# Altium project CC_V1.4.PrjPCB (part 1 of 2)
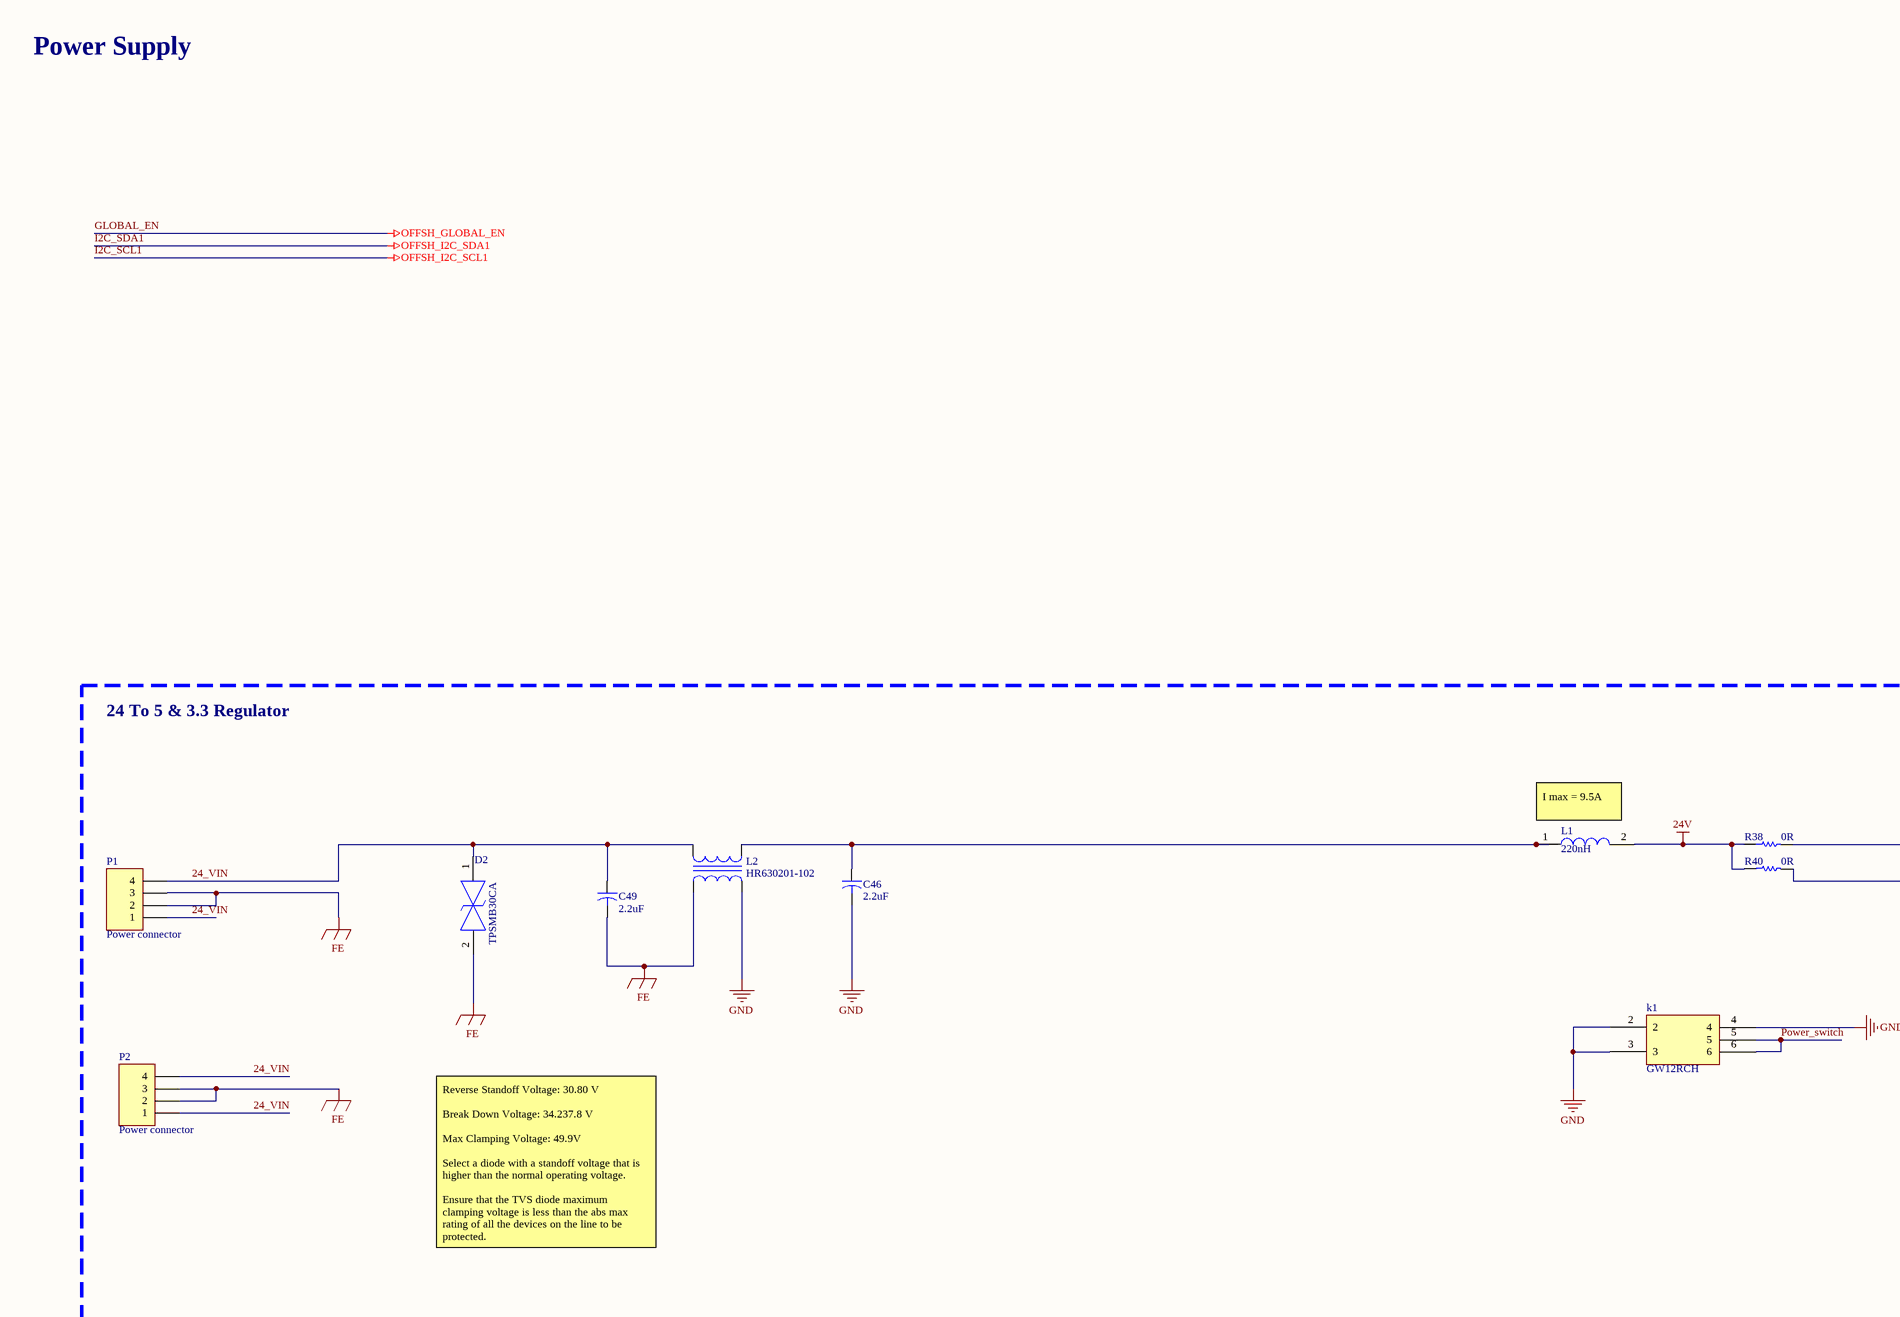
[diagram p0: Power_Supply.SchDoc, top left]
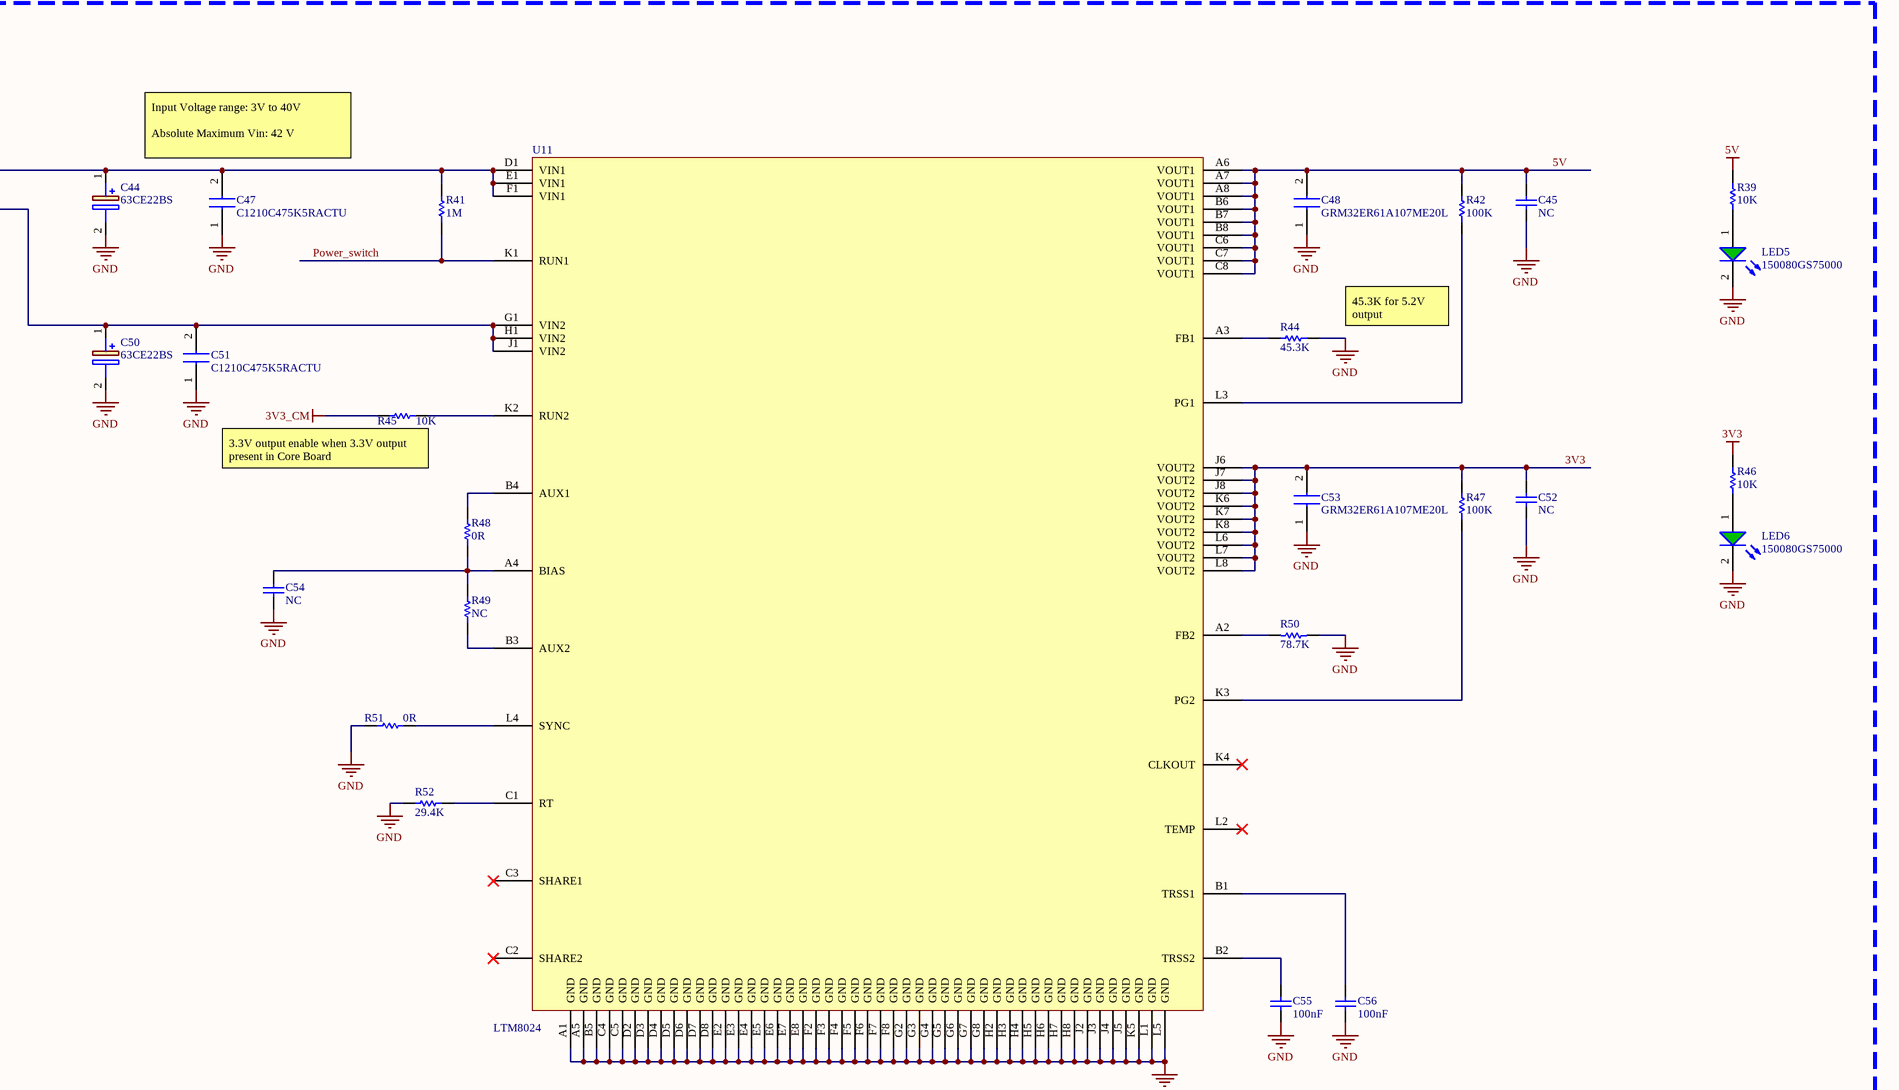
[diagram p1: Power_Supply.SchDoc, top right]
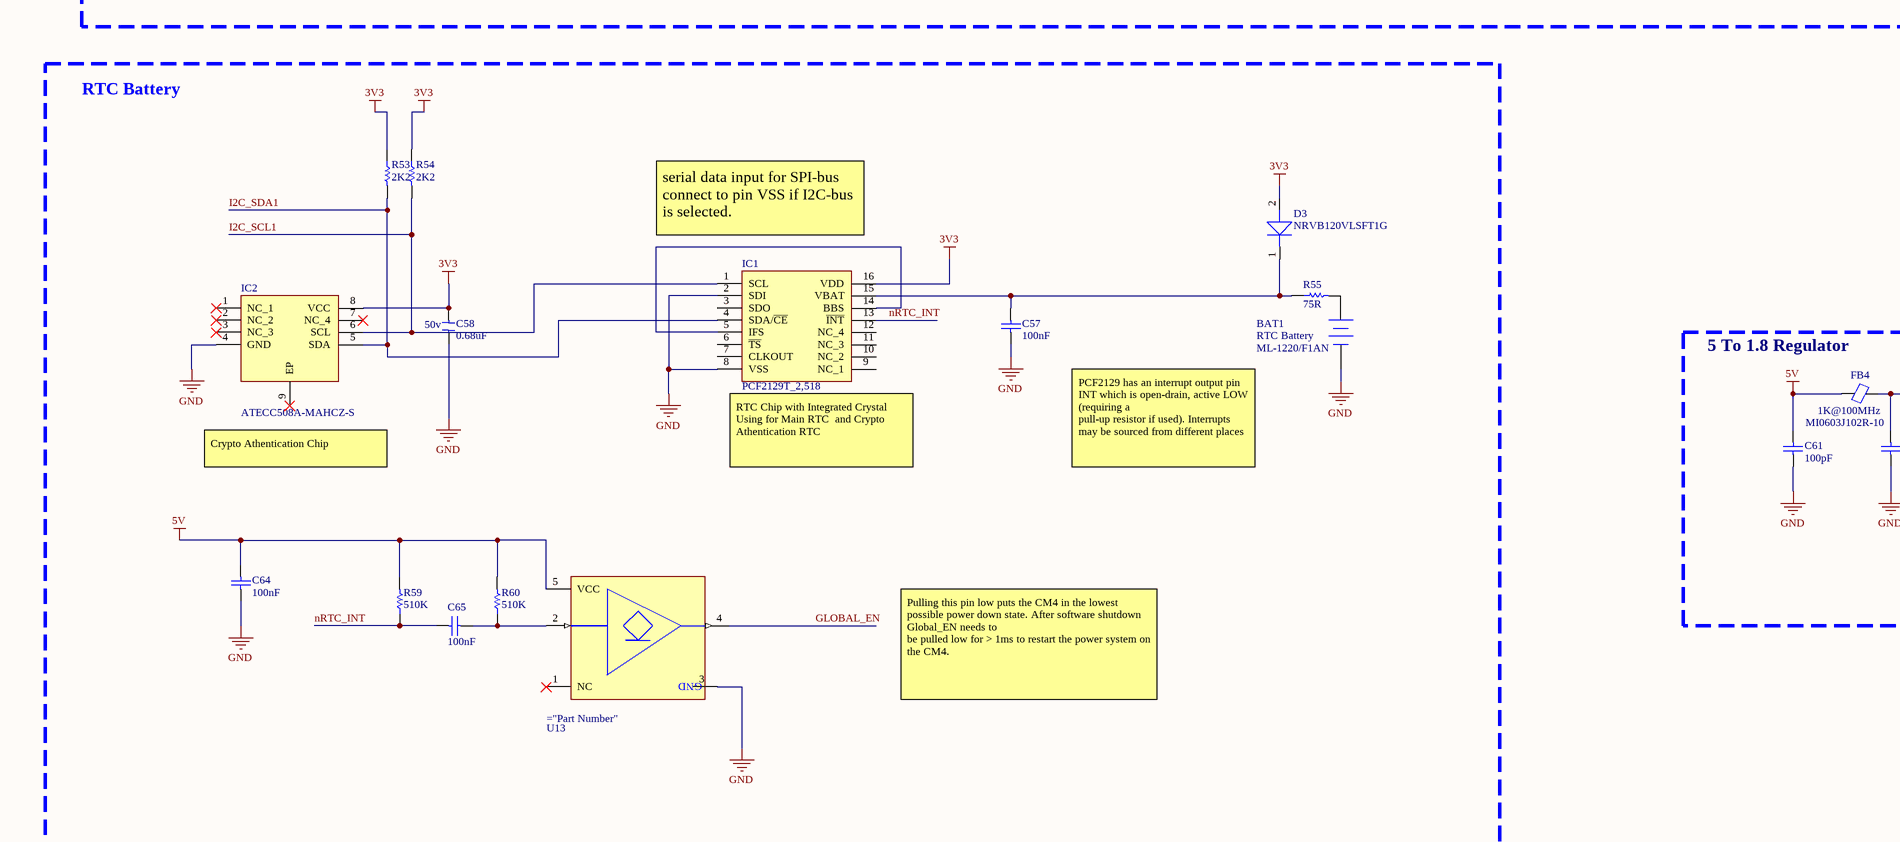
[diagram p2: Power_Supply.SchDoc, bottom left]
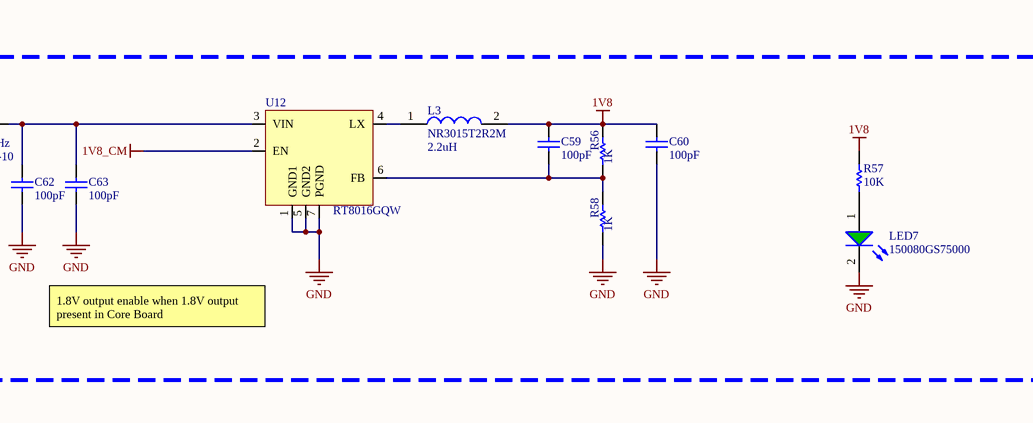
[diagram p3: Power_Supply.SchDoc, bottom right]
9 sheets, 334 parts. Net scope: global (net labels, ports and power ports of the same name join across sheets).
Board file: CC_V1.4.PcbDoc
Sheets:
  Power_Supply.SchDoc
  SPI_To_Ethernet.SchDoc
  HDMI_MicroUSB.SchDoc
  USB_To_Ethernet.SchDoc
  CoreBoard.SchDoc
  4G.SchDoc
  LCD.SchDoc
  DIO.SchDoc
  Audio.SchDoc

## Sheet Power_Supply.SchDoc
size A1

### Parts
(Parts that share a designator on the sheet are numbered #1, #2 ... from top to bottom, then left to right.)
BAT1  RTC Battery  Part Number: ML-1220/F1AN  [ML-1220F1AN]
C44  63CE22BS  [63CE22BS]
C45  value NC  [CAP (0603)]  (hidden comment: Cap)
C46  value 2.2uF  [TANTAL (SIZE B)]  (hidden comment: Cap_Tantal)
C47  C1210C475K5RACTU  [CAPC3225X280N]
C48  GRM32ER61A107ME20L  [CAPC3225X270N]
C49  value 2.2uF  [TANTAL (SIZE B)]  (hidden comment: Cap_Tantal)
C50  63CE22BS  [63CE22BS]
C51  C1210C475K5RACTU  [CAPC3225X280N]
C52  value NC  [CAP (0603)]  (hidden comment: Cap)
C53  GRM32ER61A107ME20L  [CAPC3225X270N]
C54  value NC  [CAP (0603)]  (hidden comment: Cap)
C55  value 100nF  [CAP (0603)]  (hidden comment: Cap)
C56  value 100nF  [CAP (0603)]  (hidden comment: Cap)
C57  value 100nF  [CAP (0603)]  (hidden comment: Cap)
C58  value 0.68uF  Voltage: 50v  [0603 Capacitor]  (hidden comment: Capacitor SMD)
C59  value 100pF  [CAP (0603)]  (hidden comment: Cap)
C60  value 100pF  [CAP (0603)]  (hidden comment: Cap)
C61  value 100pF  [CAP (0603)]  (hidden comment: Cap)
C62  value 100pF  [CAP (0603)]  (hidden comment: Cap)
C63  value 100pF  [CAP (0603)]  (hidden comment: Cap)
C64  value 100nF  [CAP (0603)]  (hidden comment: Cap)
C65  value 100nF  [CAP (0603)]  (hidden comment: Cap)
D2  TPSMB30CA  [DIONM5444X261N]
D3  Schottky Diode  [SODFL3616X98N (SOD-123FL)]  (value not drawn)
FB4  value 1K@100MHz  Part Number: MI0603J102R-10  [FB0603]  (hidden comment: Ferrite Bead)
IC1  PCF2129T_2,518  [SOIC127P1032X265-16N]
IC2  ATECC508A-MAHCZ-S  [DFN200X300X60-9N]
k1  GW12RCH  [PCBComponent_1]
L1#1  220nH  [WE-LHMI_402048]
L2  HR630201-102  [PCBComponent_1 - duplicate]
L3  value 2.2uH  [NR3015T2R2M]  (hidden comment: Inductor)
LED5  150080GS75000  [LED_0805_Green]
LED6  150080GS75000  [LED_0805_Green]
LED7  150080GS75000  [LED_0805_Green]
P1  Power connector  [XH_4Pin]
P2  Power connector  [XH_4Pin]
R38  value 0R  [RES (0603)]  (hidden comment: Res)
R39  value 10K  [R0603]  (hidden comment: Res)
R40  value 0R  [RES (0603)]  (hidden comment: Res)
R41  value 1M  [RES 0603]  (hidden comment: Res)
R42  value 100K  [RES (0603)]  (hidden comment: Res)
R44  value 45.3K  [RES (0603)]  (hidden comment: Res)
R45  value 10K  [RES (0603)]  (hidden comment: Res)
R46  value 10K  [R0603]  (hidden comment: Res)
R47  value 100K  [RES (0603)]  (hidden comment: Res)
R48  value 0R  [RES (0603)]  (hidden comment: Res)
R49  value NC  [RES (0603)]  (hidden comment: Res)
R50  value 78.7K  [RES (0603)]  (hidden comment: Res)
R51  value 0R  [RES (0603)]  (hidden comment: Res)
R52  value 29.4K  [RES (0603)]  (hidden comment: Res)
R53  value 2K2  [RES 0603]  (hidden comment: Res)
R54  value 2K2  [RES 0603]  (hidden comment: Res)
R55  value 75R  [RES (0603)]  (hidden comment: Res)
R56  value 1K  [R0603]  (hidden comment: Res)
R57  value 10K  [R0603]  (hidden comment: Res)
R58  value 1K  [R0603]  (hidden comment: Res)
R59  value 510K  [RES (0603)]  (hidden comment: Res)
R60  value 510K  [RES (0603)]  (hidden comment: Res)
U11  LTM8024  [BGA88C100P8X11_900X1125X352]
U12  RT8016GQW  [SON65P200X200X80-7N (WDFN-6L)]
U13  74LVC1G07SE-7  [SOT65P210X110-5N]  (value not drawn)

### Nets
1V8: C59.1 C60.1 L3.2 R56.2 R57.1
1V8_CM: U12.2(EN)
3V3: C52.1 C53.2 C58.2 D3.2(A) IC1.16(VDD) IC2.8(VCC) R46.1 R47.2 R53.1 R54.1 U11.J6(VOUT2) U11.J7(VOUT2) U11.J8(VOUT2) U11.K6(VOUT2) U11.K7(VOUT2) U11.K8(VOUT2) U11.L6(VOUT2) U11.L7(VOUT2) U11.L8(VOUT2)
3V3_CM: R45.2
5V: C45.1 C48.2 C61.1 C64.1 FB4.1 R39.1 R42.2 R59.2 R60.2 U11.A6(VOUT1) U11.A7(VOUT1) U11.A8(VOUT1) U11.B6(VOUT1) U11.B7(VOUT1) U11.B8(VOUT1) U11.C6(VOUT1) U11.C7(VOUT1) U11.C8(VOUT1) U13.5(VCC)
24V: L1#1.2 R38.1 R40.1
FE: C49.2 D2.2 L2.4 P1.2 P1.3 P2.2 P2.3
GLOBAL_EN: U13.4(Y)  [also labelled OFFSH_GLOBAL_EN]
GND: BAT1.2(-) C44.2(-) C45.2 C46.2 C47.1 C48.1 C50.2(-) C51.1 C52.2 C53.1 C54.1 C55.1 C56.1 C57.2 C58.1 C60.2 C61.2 C62.2 C63.2 C64.2 IC1.2(SDI) IC1.8(VSS) IC2.4(GND) k1.2 k1.3 k1.4 L2.2 LED5.2(C) LED6.2(C) LED7.2(C) R44.1 R50.1 R51.1 R52.2 R58.1 U11.A1(GND) U11.A5(GND) U11.B5(GND) U11.C4(GND) U11.C5(GND) U11.D2(GND) U11.D3(GND) U11.D4(GND) U11.D5(GND) U11.D6(GND) U11.D7(GND) U11.D8(GND) U11.E2(GND) U11.E3(GND) U11.E4(GND) U11.E5(GND) U11.E6(GND) U11.E7(GND) U11.E8(GND) U11.F2(GND) U11.F3(GND) U11.F4(GND) U11.F5(GND) U11.F6(GND) U11.F7(GND) U11.F8(GND) U11.G2(GND) U11.G3(GND) U11.G4(GND) U11.G5(GND) U11.G6(GND) U11.G7(GND) U11.G8(GND) U11.H2(GND) U11.H3(GND) U11.H4(GND) U11.H5(GND) U11.H6(GND) U11.H7(GND) U11.H8(GND) U11.J2(GND) U11.J3(GND) U11.J4(GND) U11.J5(GND) U11.K5(GND) U11.L1(GND) U11.L5(GND) U12.1(GND1) U12.5(GND2) U12.7(PGND)
I2C_SCL1: IC1.1(SCL) IC2.6(SCL) R54.2  [also labelled OFFSH_I2C_SCL1]
I2C_SDA1: IC1.4(SDA/~{CE}) IC2.5(SDA) R53.2  [also labelled OFFSH_I2C_SDA1]
24_VIN: C49.1 D2.1 L2.3 P1.1 P1.4 P2.1 P2.4
nRTC_INT: C65.2 IC1.13(~{INT}) R59.1
Power_switch: k1.5 k1.6 R41.1 U11.K1(RUN1)
NetBAT1_1: BAT1.1(+) R55.2
NetC44_1: C44.1(+) C47.2 R38.2 R41.2 U11.D1(VIN1) U11.E1(VIN1) U11.F1(VIN1)
NetC46_1: C46.1 L1#1.1 L2.1
NetC50_1: C50.1(+) C51.2 R40.2 U11.G1(VIN2) U11.H1(VIN2) U11.J1(VIN2)
NetC54_2: C54.2 R48.1 R49.2 U11.A4(BIAS)
NetC55_2: C55.2 U11.B2(TRSS2)
NetC56_2: C56.2 U11.B1(TRSS1)
NetC57_1: C57.1 D3.1(K) IC1.15(VBAT) R55.1
NetC59_2: C59.2 R56.1 R58.2 U12.6(FB)
NetC62_1: C62.1 C63.1 FB4.2 U12.3(VIN)
NetC65_1: C65.1 R60.1 U13.2(A)
NetIC1_5: IC1.5(IFS) IC1.14(BBS)
NetL3_1: L3.1 U12.4(LX)
NetLED5_1: LED5.1(A) R39.2
NetLED6_1: LED6.1(A) R46.2
NetLED7_1: LED7.1(A) R57.2
NetR42_1: R42.1 U11.L3(PG1)
NetR44_2: R44.2 U11.A3(FB1)
NetR45_1: R45.1 U11.K2(RUN2)
NetR47_1: R47.1 U11.K3(PG2)
NetR48_2: R48.2 U11.B4(AUX1)
NetR49_1: R49.1 U11.B3(AUX2)
NetR50_2: R50.2 U11.A2(FB2)
NetR51_2: R51.2 U11.L4(SYNC)
NetR52_1: R52.1 U11.C1(RT)

Not connected (* = marked no-connect by the designer): IC1 3(SDO) 6(~{TS}) 7(CLKOUT) 9(NC_1) 10(NC_2) 11(NC_3) 12(NC_4); IC2 1(NC_1)* 2(NC_2)* 3(NC_3)* 7(NC_4)* 9(EP)*; U11 C2(SHARE2)* C3(SHARE1)* K4(CLKOUT)* L2(TEMP)*; U13 1(NC)* 3(GND)

### Notes on the sheet
- Power Supply
- 24 To 5 & 3.3 Regulator
- (near L1#1) I max = 9.5A
- Input Voltage range: 3V to 40V
  Absolute Maximum Vin: 42 V
- (near R44) 45.3K for 5.2V output
- (near R45) 3.3V output enable when 3.3V output present in Core Board
- Reverse Standoff Voltage: 30.80 V
  Break Down Voltage: 34.237.8 V
  Max Clamping Voltage: 49.9V
  Select a diode with a standoff voltage that is higher than the normal operating voltage.
  Ensure that the TVS diode maximum clamping voltage is less than the abs max rating of all the devices on the line to be protected.
- RTC Battery
- serial data input for SPI-bus
  connect to pin VSS if I2C-bus is selected.
- (near FB4) 5 To 1.8 Regulator
- Crypto Athentication Chip
- (near IC1) RTC Chip with Integrated Crystal
  Using for Main RTC  and Crypto Athentication RTC
- PCF2129 has an interrupt output pin INT which is open-drain, active LOW (requiring a
  pull-up resistor if used). Interrupts may be sourced from different places
- 1.8V output enable when 1.8V output present in Core Board
- Pulling this pin low puts the CM4 in the lowest possible power down state. After software shutdown Global_EN needs to
  be pulled low for > 1ms to restart the power system on the CM4.

### Library data of the parts
BAT1 = RTC BAT (ML-1220_F1AN): Manufacturer_Name: Panasonic Battery; Datasheet Link: http://media.digikey.com/pdf/Data%20Sheets/Panasonic%20Inustrial/ML_Serie.pdf; Link: https://www.digikey.com/product-detail/en/panasonic-bsg/ML-1220-F1AN/P295-ND/447504
C44 C50 = 63CE22BS: Capacitor Polarised; Manufacturer_Name: Suncon; Value: 22uF; Datasheet Link: http://www.sunelec.co.jp/common/pdf/eng/CE-BS.pdf; Height: 8mm; Manufacturer_Part_Number: 63CE22BS; Arrow Part Number: 63CE22BS
C45 C52 C54 = Cap: SMD capacitor; Part Number: SMD CAP (0603)
C46 C49 = Cap_Tantal: Tantalum Capacitor; Voltage: 10V
C47 C51 = C1210C475K5RACTU: Capacitor, 4.7uF, 50V; Manufacturer_Name: Kemet; Datasheet Link: https://componentsearchengine.com/Datasheets/2/C1210C475K5RACTU.pdf; Height: 2.8mm; Manufacturer_Part_Number: C1210C475K5RACTU; Arrow Part Number: C1210C475K5RACTU; Arrow Price/Stock: https://www.arrow.com/en/products/c1210c475k5ractu/kemet-corporation; Mouser Part Number: 80-C1210C475K5R; Mouser Price/Stock: https://www.mouser.co.uk/ProductDetail/KEMET/C1210C475K5RACTU?qs=dB0LedT%252BmmBpncka1nOCUg%3D%3D; Value: 4.7uF; Voltage: 50V; Package: 1210
C48 C53 = GRM32ER61A107ME20L: Capacitor, 100uF, 10V; Manufacturer_Name: Murata Electronics; Datasheet Link: https://psearch.en.murata.com/capacitor/product/%23.html; Height: 2.7mm; Manufacturer_Part_Number: GRM32ER61A107ME20L; Arrow Part Number: GRM32ER61A107ME20L; Arrow Price/Stock: https://www.arrow.com/en/products/grm32er61a107me20l/murata-manufacturing; Mouser Part Number: 81-GRM32ER61A107ME0L; Mouser Price/Stock: https://www.mouser.co.uk/ProductDetail/Murata-Electronics/GRM32ER61A107ME20L?qs=QRVci0nWsCb7NlWFDLlBHA%3D%3D; Value: 100uF
C55-C57 C61-C65 = Cap: SMD capacitor; Part Number: SMD CAP (0603); Voltage: 50V
C59 C60 = Cap: SMD capacitor; Voltage: 50V
D2 = TPSMB62CA: Partnumber : TPSMB110CA; Manufacturer_Part_Number: TPSMB110CA
D3 = NRVB120VLSFT1G: Manufacturer_Name: ON Semiconductor; Datasheet Link: http://www.onsemi.com/pub/Collateral/MBR120VLSFT1-D.PDF; Height: 0.98mm; Link: https://www.digikey.com/product-detail/en/on-semiconductor/NRVB120VLSFT1G/NRVB120VLSFT1GOSCT-ND/8538727; Part Number: NRVB120VLSFT1G
FB4 = Ferrite Bead: Ferrite Bead SMD; Link: https://www.digikey.com/product-detail/en/laird-signal-integrity-products/MI0805J102R-10/240-2551-1-ND/1015989
IC1 = PCF2129T_2,518: Integrated Circuit; Manufacturer_Name: NXP; Manufacturer_Part_Number: PCF2129T/2,518; Datasheet Link: http://www.nxp.com/docs/en/data-sheet/PCF2129.pdf; Height: 2.65mm; Mouser Part Number: 771-PCF2129T/2,518; Mouser Price/Stock: https://www.mouser.co.uk/ProductDetail/NXP-Semiconductors/PCF2129T-2518/?qs=O0BhuZj9Wkzo98h9NloC7Q%3D%3D; Arrow Part Number: PCF2129T/2,518; Arrow Price/Stock: https://www.arrow.com/en/products/pcf2129t2518/nxp-semiconductors
IC2 = ATECC508A-MAHCZ-S: Integrated Circuit; Manufacturer_Name: Microchip; Datasheet Link: http://www.mouser.com/ds/2/268/Atmel-8923S-CryptoAuth-ATECC508A-Datasheet-Summary-1065793.pdf; Height: 0.6mm; Manufacturer_Part_Number: ATECC508A-MAHCZ-S; Mouser Part Number: 556-ATECC508AMAHCZS; Mouser Price/Stock: https://www.mouser.co.uk/ProductDetail/Microchip-Technology-Atmel/ATECC508A-MAHCZ-S?qs=%2FPOkb%252BiDxRUOydmISUnqmg%3D%3D; Arrow Part Number: ATECC508A-MAHCZ-S; Arrow Price/Stock: https://www.arrow.com/en/products/atecc508a-mahcz-s/microchip-technology
L1#1 = 744373240022: Manufacturer_Name: Wurth Elektronik; Datasheet Link: http://componentsearchengine.com/Datasheets/1/744373240022.pdf; Manufacturer_Part_Number: 744373240022; Arrow Part Number: 744373240022; Mouser Part Number: 710-744373240022; Mouser Price/Stock: https://www.mouser.co.uk/ProductDetail/Wurth-Elektronik/744373240022?qs=cFlH0mFHHFrAuUoRjqUUNw%3D%3D; Part Number: 744373240022
L2 = TRANS1
L3 = NR3015T2R2M: Manufacturer_Name: TAIYO YUDEN; Datasheet Link: http://ds.yuden.co.jp/TYCOMPAS/ut/detail.do?productNo=NR3015T2R2M&fileName=NR3015T2R2M_SS&mode=specSheetDownload; Link: https://www.digikey.com/product-detail/en/taiyo-yuden/NR3015T2R2M/587-1648-1-ND/1008263; Part Number: NR3015T2R2M
LED5-LED7 = WL-SMCW 0805  150080GS75000: SMD mono-color Chip LED, WL-SMCW, Green; Manufacturer: W黵th Elektronik eiSos GmbH; PartNo: 150080GS75000; ComponentLink1Description: Manufacturer; ComponentLink1URL: http://www.we-online.de; Created by: Christin Otto; Created Date: June 2013; ComponentLink2Description: Datasheet; ComponentLink2URL: http://katalog.we-online.com/led/datasheet/150080GS75000.pdf; Color: Green
P1 P2 = Header 4: CONN HEADER VERT 4POS 2.5MM JST Sales America Inc., B4B-XH-AM(LF)(SN); LatestRevisionDate: 17-Jul-2002; LatestRevisionNote: Re-released for DXP Platform.; Publisher: Altium Limited; Part Number: B4B-XH-AM(LF)(SN)
R38 R40-R42 R44 R45 R47-R55 = Res: SMD resistor; Tolerance: 5%
R39 R46 R56-R58 = Res: Resistor; Published: 8-Jun-2000; LatestRevisionDate: 17-Jul-2002; LatestRevisionNote: Re-released for DXP Platform.; PackageReference: AXIAL-0.3; Publisher: Altium Limited
R59 R60 = Res: SMD resistor; Tolerance: 1%
U12 = RT8016GQW: Step-Down Converter; Manufacturer_Name: RICHTEK; Datasheet Link: https://componentsearchengine.com/Datasheets/2/RT8010GQW.pdf; Height: 0.8mm; Link: https://www.digikey.com/product-detail/en/richtek-usa-inc/RT8016GQW/1028-1031-1-ND/3071294; Part Number: RT8016GQW

## Sheet SPI_To_Ethernet.SchDoc
size A1
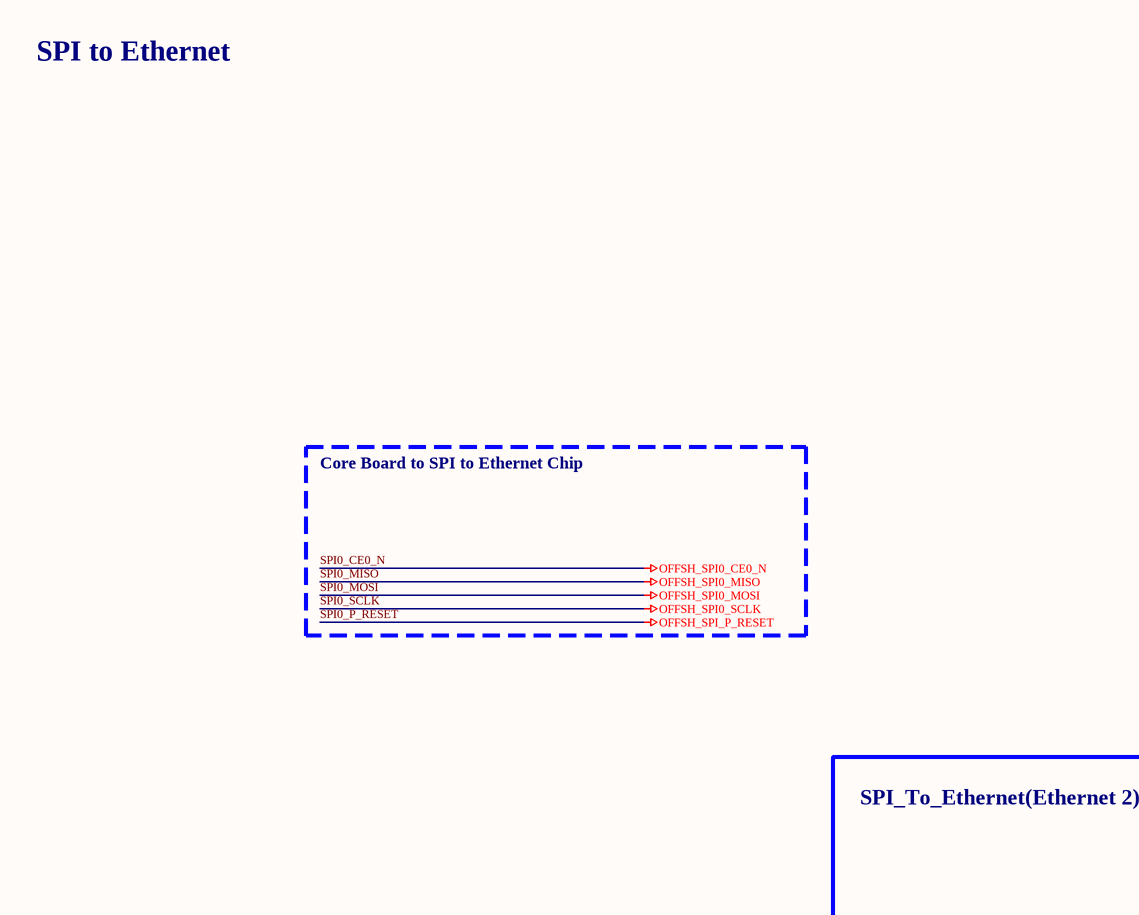
[diagram p4: SPI_To_Ethernet.SchDoc, top left]
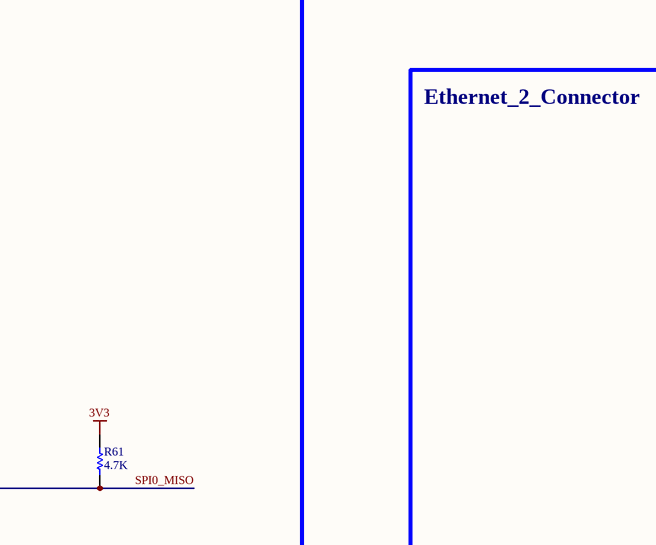
[diagram p5: SPI_To_Ethernet.SchDoc, top right]
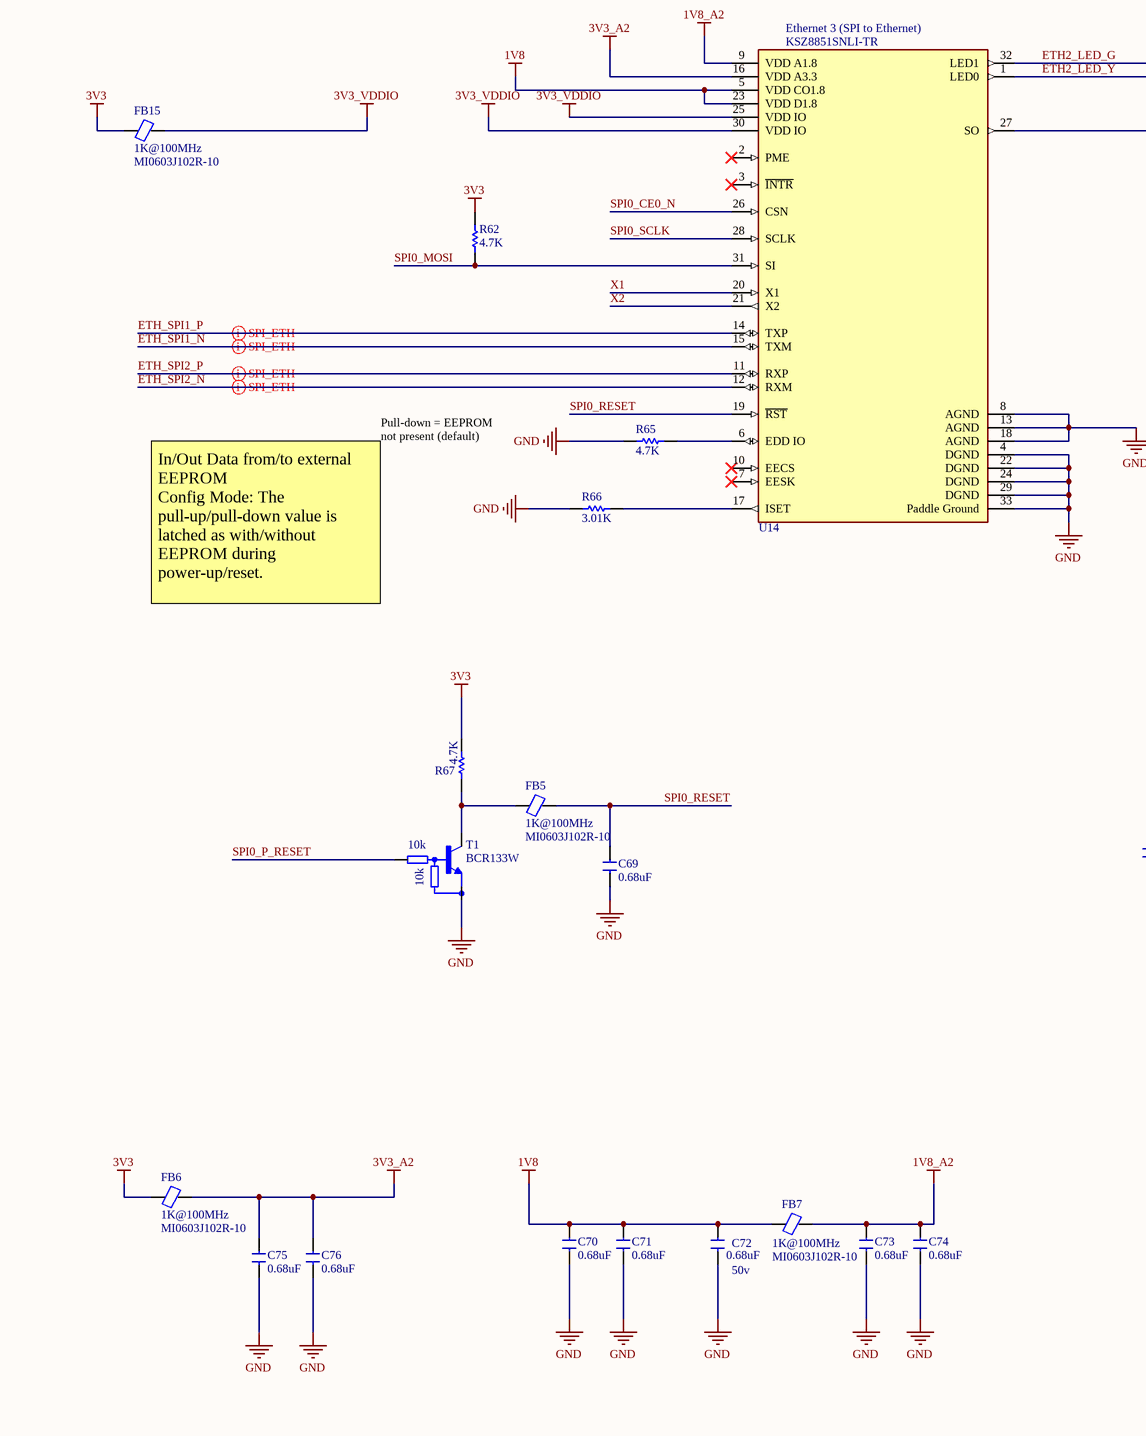
[diagram p6: SPI_To_Ethernet.SchDoc, bottom left]
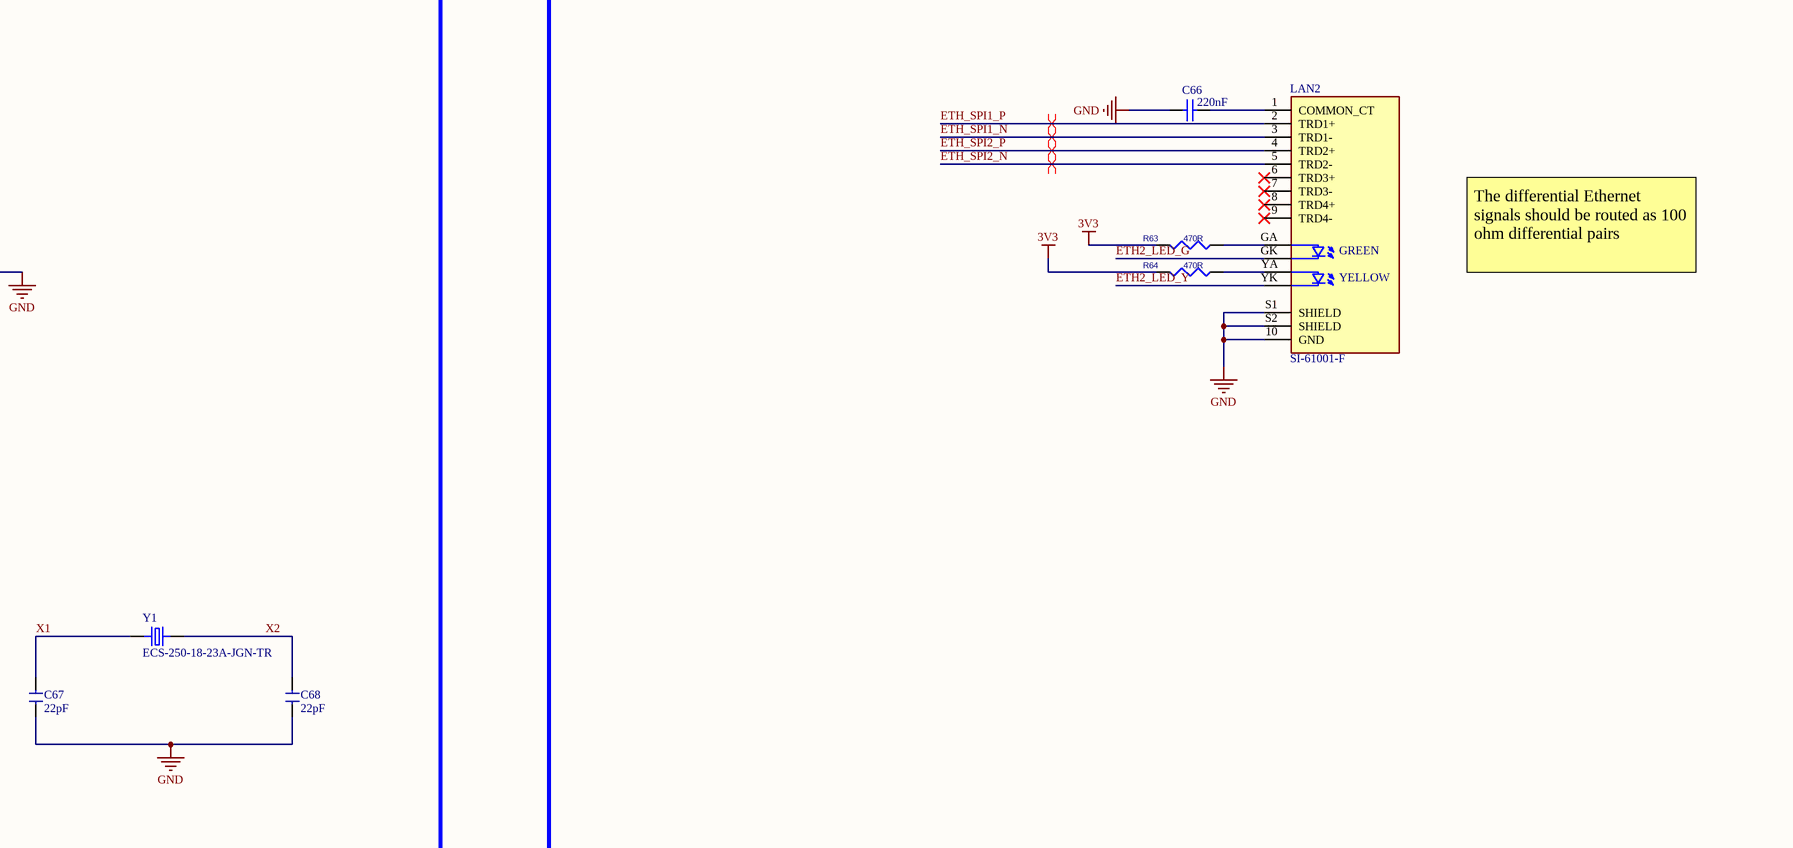
[diagram p7: SPI_To_Ethernet.SchDoc, bottom right]

### Parts
C66  value 220nF  [CAP (0603)]  (hidden comment: Cap)
C67  value 22pF  [0603 Capacitor]  (hidden comment: Capacitor SMD)
C68  value 22pF  [0603 Capacitor]  (hidden comment: Capacitor SMD)
C69  value 0.68uF  [0603 Capacitor]  (hidden comment: Capacitor SMD)
C70  value 0.68uF  [0603 Capacitor]  (hidden comment: Capacitor SMD)
C71  value 0.68uF  [0603 Capacitor]  (hidden comment: Capacitor SMD)
C72  value 0.68uF  Voltage: 50v  [0603 Capacitor]  (hidden comment: Capacitor SMD)
C73  value 0.68uF  [0603 Capacitor]  (hidden comment: Capacitor SMD)
C74  value 0.68uF  [0603 Capacitor]  (hidden comment: Capacitor SMD)
C75  value 0.68uF  [0603 Capacitor]  (hidden comment: Capacitor SMD)
C76  value 0.68uF  [0603 Capacitor]  (hidden comment: Capacitor SMD)
FB5  value 1K@100MHz  Part Number: MI0603J102R-10  [FB0603]  (hidden comment: Ferrite Bead)
FB6  value 1K@100MHz  Part Number: MI0603J102R-10  [FB0603]  (hidden comment: Ferrite Bead)
FB7  value 1K@100MHz  Part Number: MI0603J102R-10  [FB0603]  (hidden comment: Ferrite Bead)
FB15  value 1K@100MHz  Part Number: MI0603J102R-10  [FB0603]  (hidden comment: Ferrite Bead)
LAN2  SI-61001-F  [BEL_SI-61001-F]
R61  value 4.7K  [R0603]  (hidden comment: Res)
R62  value 4.7K  [R0603]  (hidden comment: Res)
R63  470R  [R0603]
R64  470R  [R0603]
R65  value 4.7K  [R0603]  (hidden comment: Res)
R66  value 3.01K  [R0603]  (hidden comment: Res)
R67  value 4.7K  [R0603]  (hidden comment: Res)
T1  BCR133W  [SOT323-BEC]
U14  KSZ8851SNLI-TR  [QFN50P500X500X90-33N]
Y1  ECS-250-18-23A-JGN-TR  [XTAL_ECS-250-18-23A-JGN-TR]

### Blocks framed on the sheet
SPI_To_Ethernet(Ethernet 2): C67-C76 FB5-FB7 FB15 R61 R62 R65-R67 T1 U14 Y1
Ethernet_2_Connector: C66 LAN2 R63 R64

### Nets
1V8: C70.1 C71.1 C72.2 FB7.1 U14.5(VDD_CO1.8) U14.23(VDD_D1.8)
1V8_A2: C73.1 C74.1 FB7.2 U14.9(VDD_A1.8)
3V3: FB6.1 FB15.1 R61.2 R62.2 R63.1 R64.1 R67.2
3V3_A2: C75.1 C76.1 FB6.2 U14.16(VDD_A3.3)
3V3_VDDIO: FB15.2 U14.25(VDD_IO) U14.30(VDD_IO)
GND: C66.1 C67.2 C68.2 C69.2 C70.2 C71.2 C72.1 C73.2 C74.2 C75.2 C76.2 LAN2.10(GND) LAN2.S1(SHIELD) LAN2.S2(SHIELD) R65.1 R66.1 T1.E U14.4(DGND) U14.8(AGND) U14.13(AGND) U14.18(AGND) U14.22(DGND) U14.24(DGND) U14.29(DGND) U14.33(Paddle_Ground)
SPI0_CE0_N: U14.26(CSN)  [also labelled OFFSH_SPI0_CE0_N]
SPI0_MISO: R61.1 U14.27(SO)  [also labelled OFFSH_SPI0_MISO]
SPI0_MOSI: R62.1 U14.31(SI)  [also labelled OFFSH_SPI0_MOSI]
SPI0_P_RESET: T1.B  [also labelled OFFSH_SPI_P_RESET]
SPI0_SCLK: U14.28(SCLK)  [also labelled OFFSH_SPI0_SCLK]
ETH2_LED_G: LAN2.GK U14.32(LED1)
ETH2_LED_Y: LAN2.YK U14.1(LED0)
ETH_SPI1_N: LAN2.3(TRD1-) U14.15(TXM)
ETH_SPI1_P: LAN2.2(TRD1+) U14.14(TXP)
ETH_SPI2_N: LAN2.5(TRD2-) U14.12(RXM)
ETH_SPI2_P: LAN2.4(TRD2+) U14.11(RXP)
SPI0_RESET: C69.1 FB5.2 U14.19(~{RST})
X1: C67.1 U14.20(X1) Y1.1(IN/OUT)
X2: C68.1 U14.21(X2) Y1.2(OUT/IN)
NetC66_2: C66.2 LAN2.1(COMMON_CT)
NetFB5_1: FB5.1 R67.1 T1.C
NetLAN2_GA: LAN2.GA R63.2
NetLAN2_YA: LAN2.YA R64.2
NetR65_2: R65.2 U14.6(EDD_IO)
NetR66_2: R66.2 U14.17(ISET)

Not connected (* = marked no-connect by the designer): LAN2 6(TRD3+)* 7(TRD3-)* 8(TRD4+)* 9(TRD4-)*; U14 2(PME)* 3(~{INTR})* 7(EESK)* 10(EECS)*

### Layout directives
differential pair; differential pair class SPI_ETH: ETH_SPI1_N, ETH_SPI1_P, ETH_SPI2_N, ETH_SPI2_P
differential pair: ETH_SPI1_N, ETH_SPI1_P, ETH_SPI2_N, ETH_SPI2_P

### Notes on the sheet
- SPI to Ethernet
- Core Board to SPI to Ethernet Chip
- (near U14) Ethernet 3 (SPI to Ethernet)
- Pull-down = EEPROM not present (default)
- The differential Ethernet signals should be routed as 100 ohm differential pairs
- In/Out Data from/to external EEPROM
  Config Mode: The pull-up/pull-down value is latched as with/without
  EEPROM during power-up/reset.
- (in symbol BCR133W) 10k
- (in symbol SI-61001-F) GREEN; YELLOW

### Library data of the parts
C66 = Cap: as C45 on sheet Power_Supply
C67-C71 C73-C76 = Capacitor SMD: Voltage: 50v
FB5-FB7 FB15 = Ferrite Bead: Ferrite Bead SMD; Link: https://www.digikey.com/product-detail/en/laird-signal-integrity-products/MI0805J102R-10/240-2551-1-ND/1015989
LAN2 = SI-61001-F: Conn RJ-45 RCP 8 POS 1.27mm Solder RA Thru-Hole 14 Terminal 1 Port; MF: Bel Magnetic Solutions; Value: *; MP: SI-61001-F; Price: None; Availability: Unavailable; Package: None; SnapEDA_Link: https://www.snapeda.com/parts/SI-61001-F/Bel%20Magnetic%20Solutions/view-part/4791152/?ref=snap
R61 R62 R65-R67 = Res: Resistor; Published: 8-Jun-2000; LatestRevisionDate: 17-Jul-2002; LatestRevisionNote: Re-released for DXP Platform.; PackageReference: AXIAL-0.3; Publisher: Altium Limited
R63 R64 = RES: Value: 470
T1 = BCR133W: <b>NPN Silicon Digital Transistor</b>  50V 0,1A 0,25W; Package: None; Price: None; Value: *; MP: BCR133W; Availability: Unavailable
Y1 = ECS-250-18-23A-JGN-TR: Crystal 2-SMD, No Lead; Package: None; Price: None; Value: *; MP: ECS-250-18-23A-JGN-TR; Availability: Unavailable

## Sheet HDMI_MicroUSB.SchDoc
size A1
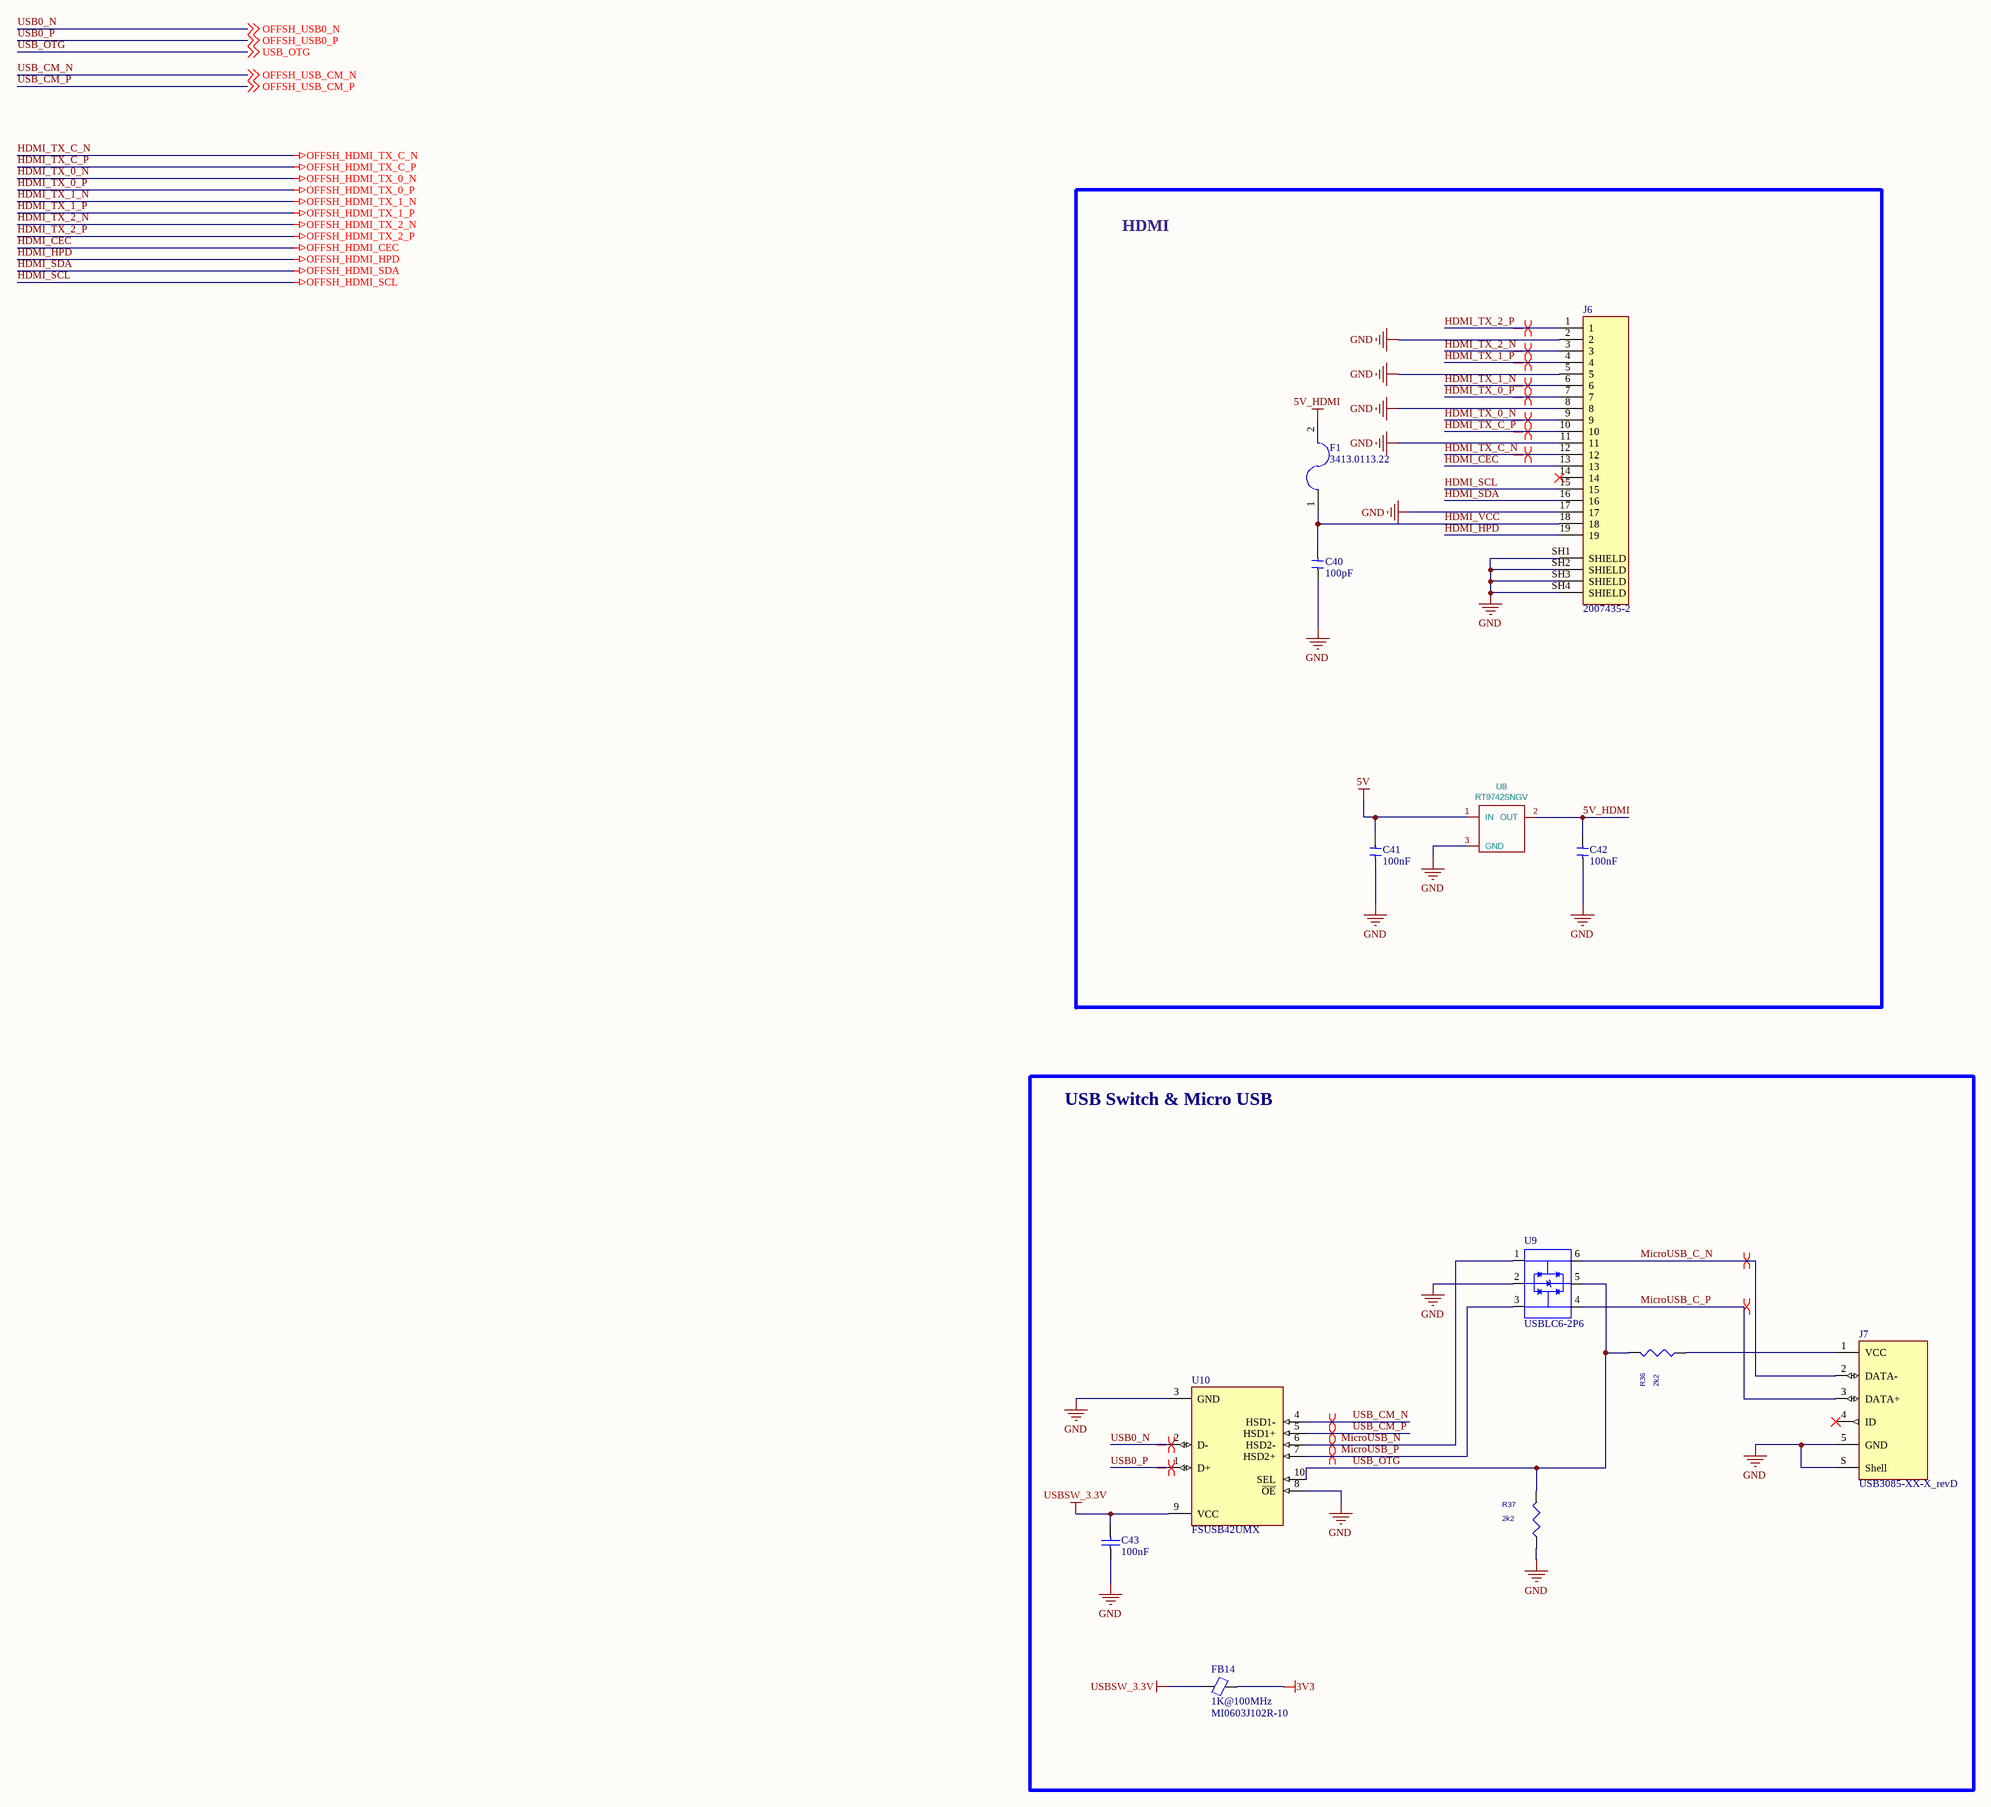
[diagram p8: HDMI_MicroUSB.SchDoc]

### Parts
C40  value 100pF  [0603 Capacitor]  (hidden comment: Capacitor SMD)
C41  value 100nF  [0603 Capacitor]  (hidden comment: Capacitor SMD)
C42  value 100nF  [0603 Capacitor]  (hidden comment: Capacitor SMD)
C43  value 100nF  [CAP (0603)]  (hidden comment: Cap)
F1  Part Number: 3413.0113.22  [FUSE (3413.0120.22)]  (hidden comment: Fuse)
FB14  value 1K@100MHz  Part Number: MI0603J102R-10  [FB0603]  (hidden comment: Ferrite Bead)
J6  2007435-2  [TE_2007435-2]
J7  USB3085-XX-X_revD  [USB3085-XX-X_revD]
R36  2k2  [R0603]
R37  2k2  [R0603]
U8  RT9742SNGV  [SOT-23]
U9  USBLC6-2P6  [SOT50P160X60-6N]
U10  FSUSB42UMX  [ON_Semiconductor_523BC_MFG]

### Blocks framed on the sheet
HDMI: C40-C42 F1 J6 U8
USB Switch & Micro USB: C43 FB14 J7 R36 R37 U9 U10

### Nets
3V3: FB14.2
5V: C41.1 U8.1(IN)
5V_HDMI: C42.1 F1.2 U8.2(OUT)
GND: C40.2 C41.2 C42.2 C43.1 J6.2 J6.5 J6.8 J6.11 J6.17 J6.SH1(SHIELD) J6.SH2(SHIELD) J6.SH3(SHIELD) J6.SH4(SHIELD) J7.5(GND) J7.S(Shell) R37.2 U8.3(GND) U9.2(GND) U10.3(GND) U10.8(~{OE})
HDMI_CEC: J6.13  [also labelled OFFSH_HDMI_CEC]
HDMI_HPD: J6.19  [also labelled OFFSH_HDMI_HPD]
HDMI_SCL: J6.15  [also labelled OFFSH_HDMI_SCL]
HDMI_SDA: J6.16  [also labelled OFFSH_HDMI_SDA]
HDMI_TX_0_N: J6.9  [also labelled OFFSH_HDMI_TX_0_N]
HDMI_TX_0_P: J6.7  [also labelled OFFSH_HDMI_TX_0_P]
HDMI_TX_1_N: J6.6  [also labelled OFFSH_HDMI_TX_1_N]
HDMI_TX_1_P: J6.4  [also labelled OFFSH_HDMI_TX_1_P]
HDMI_TX_2_N: J6.3  [also labelled OFFSH_HDMI_TX_2_N]
HDMI_TX_2_P: J6.1  [also labelled OFFSH_HDMI_TX_2_P]
HDMI_TX_C_N: J6.12  [also labelled OFFSH_HDMI_TX_C_N]
HDMI_TX_C_P: J6.10  [also labelled OFFSH_HDMI_TX_C_P]
USBSW_3.3V: C43.2 FB14.1 U10.9(VCC)
HDMI_VCC: C40.1 F1.1 J6.18
MicroUSB_C_N: J7.2(DATA-) U9.6(I/O1_2)
MicroUSB_C_P: J7.3(DATA+) U9.4(I/O2_2)
MicroUSB_N: U9.1(I/O1_1) U10.6(HSD2-)
MicroUSB_P: U9.3(I/O2_1) U10.7(HSD2+)
USB0_N: U10.2(D-) ; off-sheet OFFSH_USB0_N  [also labelled OFFSH_USB0_N]
USB0_P: U10.1(D+) ; off-sheet OFFSH_USB0_P  [also labelled OFFSH_USB0_P]
USB_CM_N: U10.4(HSD1-) ; off-sheet OFFSH_USB_CM_N  [also labelled OFFSH_USB_CM_N]
USB_CM_P: U10.5(HSD1+) ; off-sheet OFFSH_USB_CM_P  [also labelled OFFSH_USB_CM_P]
USB_OTG: R36.1 R37.1 U9.5(VBUS) U10.10(SEL) ; off-sheet USB_OTG
NetJ7_1: J7.1(VCC) R36.2

Not connected (* = marked no-connect by the designer): J6 14*; J7 4(ID)*

### Layout directives
differential pair: HDMI_TX_0_N, HDMI_TX_0_P, HDMI_TX_1_N, HDMI_TX_1_P, HDMI_TX_2_N, HDMI_TX_2_P, HDMI_TX_C_N, HDMI_TX_C_P, MicroUSB_C_N, MicroUSB_C_P, MicroUSB_N, MicroUSB_P, USB0_N, USB0_P, USB_CM_N, USB_CM_P

### Library data of the parts
C40 C42 = Capacitor SMD: Voltage: 50v
C41 = Capacitor SMD: SMD capacitor; Voltage: 50v
C43 = Cap: SMD capacitor; Voltage: 50V
F1 = Fuse (3413.0113.22): USB Host Fuse; Manufacturer_Name: SCHURTER; Datasheet Link: http://docs-emea.rs-online.com/webdocs/0ce7/0900766b80ce74f5.pdf; Height: 0.6mm; Link: https://www.digikey.sg/product-detail/en/schurter-inc/3413.0113.22/486-1675-1-ND/2870075
FB14 = Ferrite Bead: Ferrite Bead SMD; Link: https://www.digikey.com/product-detail/en/laird-signal-integrity-products/MI0805J102R-10/240-2551-1-ND/1015989
J6 = 2007435-2: Conn HDMI RCP 19 POS Solder RA Thru-Hole 19 Terminal 1 Port T/R; MF: TE Connectivity; Value: *; Package: None; MP: 2007435-2; Price: None; Availability: Unavailable; SnapEDA_Link: https://www.snapeda.com/parts/2007435-2/TE%20Connectivity%20AMP%20Connectors/view-part/1316516/?ref=snap
J7 = USB3085-XX-X_revD: Micro USB Receptacle, Type AB, SMT, Horizontal, Bottom Mount, without Peg
R36 R37 = RES: Value: 470
U8 = RT9742SNGV: Part Description: Power Switch/Driver 1:1 N-Channel 500mA SOT-23-3; Field4: Farnell; Field5: 2575555; Field7: RichTek; Field8: USWI00155; Field6: RT9742SNGV; Value: RT9742SNGV; Footprint: Package_TO_SOT_SMD:SOT-23
U9 = USBLC6-2P6: 17V Clamp 5A _8/20Âµs_ Ipp Tvs Diode Surface Mount SOT-666; MF: STMicroelectronics; Value: *; MP: USBLC6-2P6; SnapEDA_Link: https://www.snapeda.com/parts/USBLC6-2P6/STMicroelectronics/view-part/106846/?ref=snap; Availability: Unavailable; Price: None; Package: SOT-563 STMicroelectronics
U10 = FSUSB42UMX: USB Switch IC 1 Channel 10-UMLP _1.8x1.4_; MF: ON Semiconductor; Package: UFQFN-10 ON Semiconductor; SnapEDA_Link: https://www.snapeda.com/parts/FSUSB42UMX/ON%20Semiconductor/view-part/1672388/?ref=snap; MP: FSUSB42UMX; Value: *; Availability: Unavailable; Price: None

## Sheet USB_To_Ethernet.SchDoc
size A0
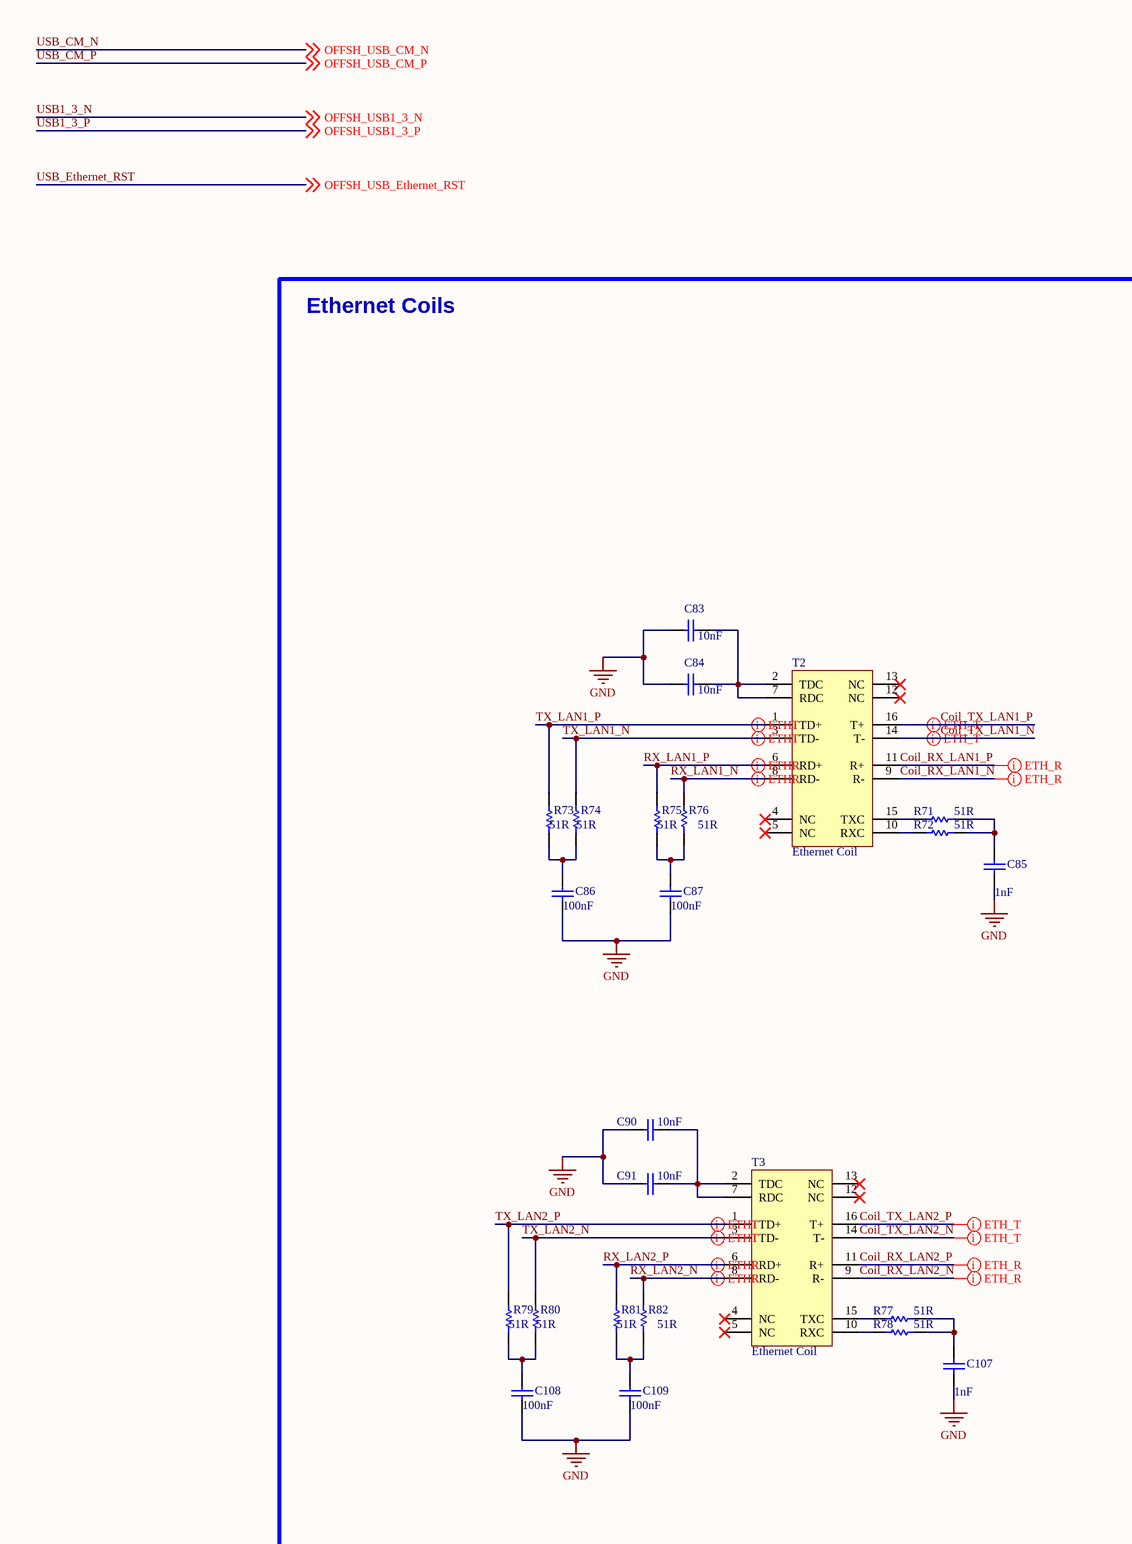
[diagram p9: USB_To_Ethernet.SchDoc, top left]
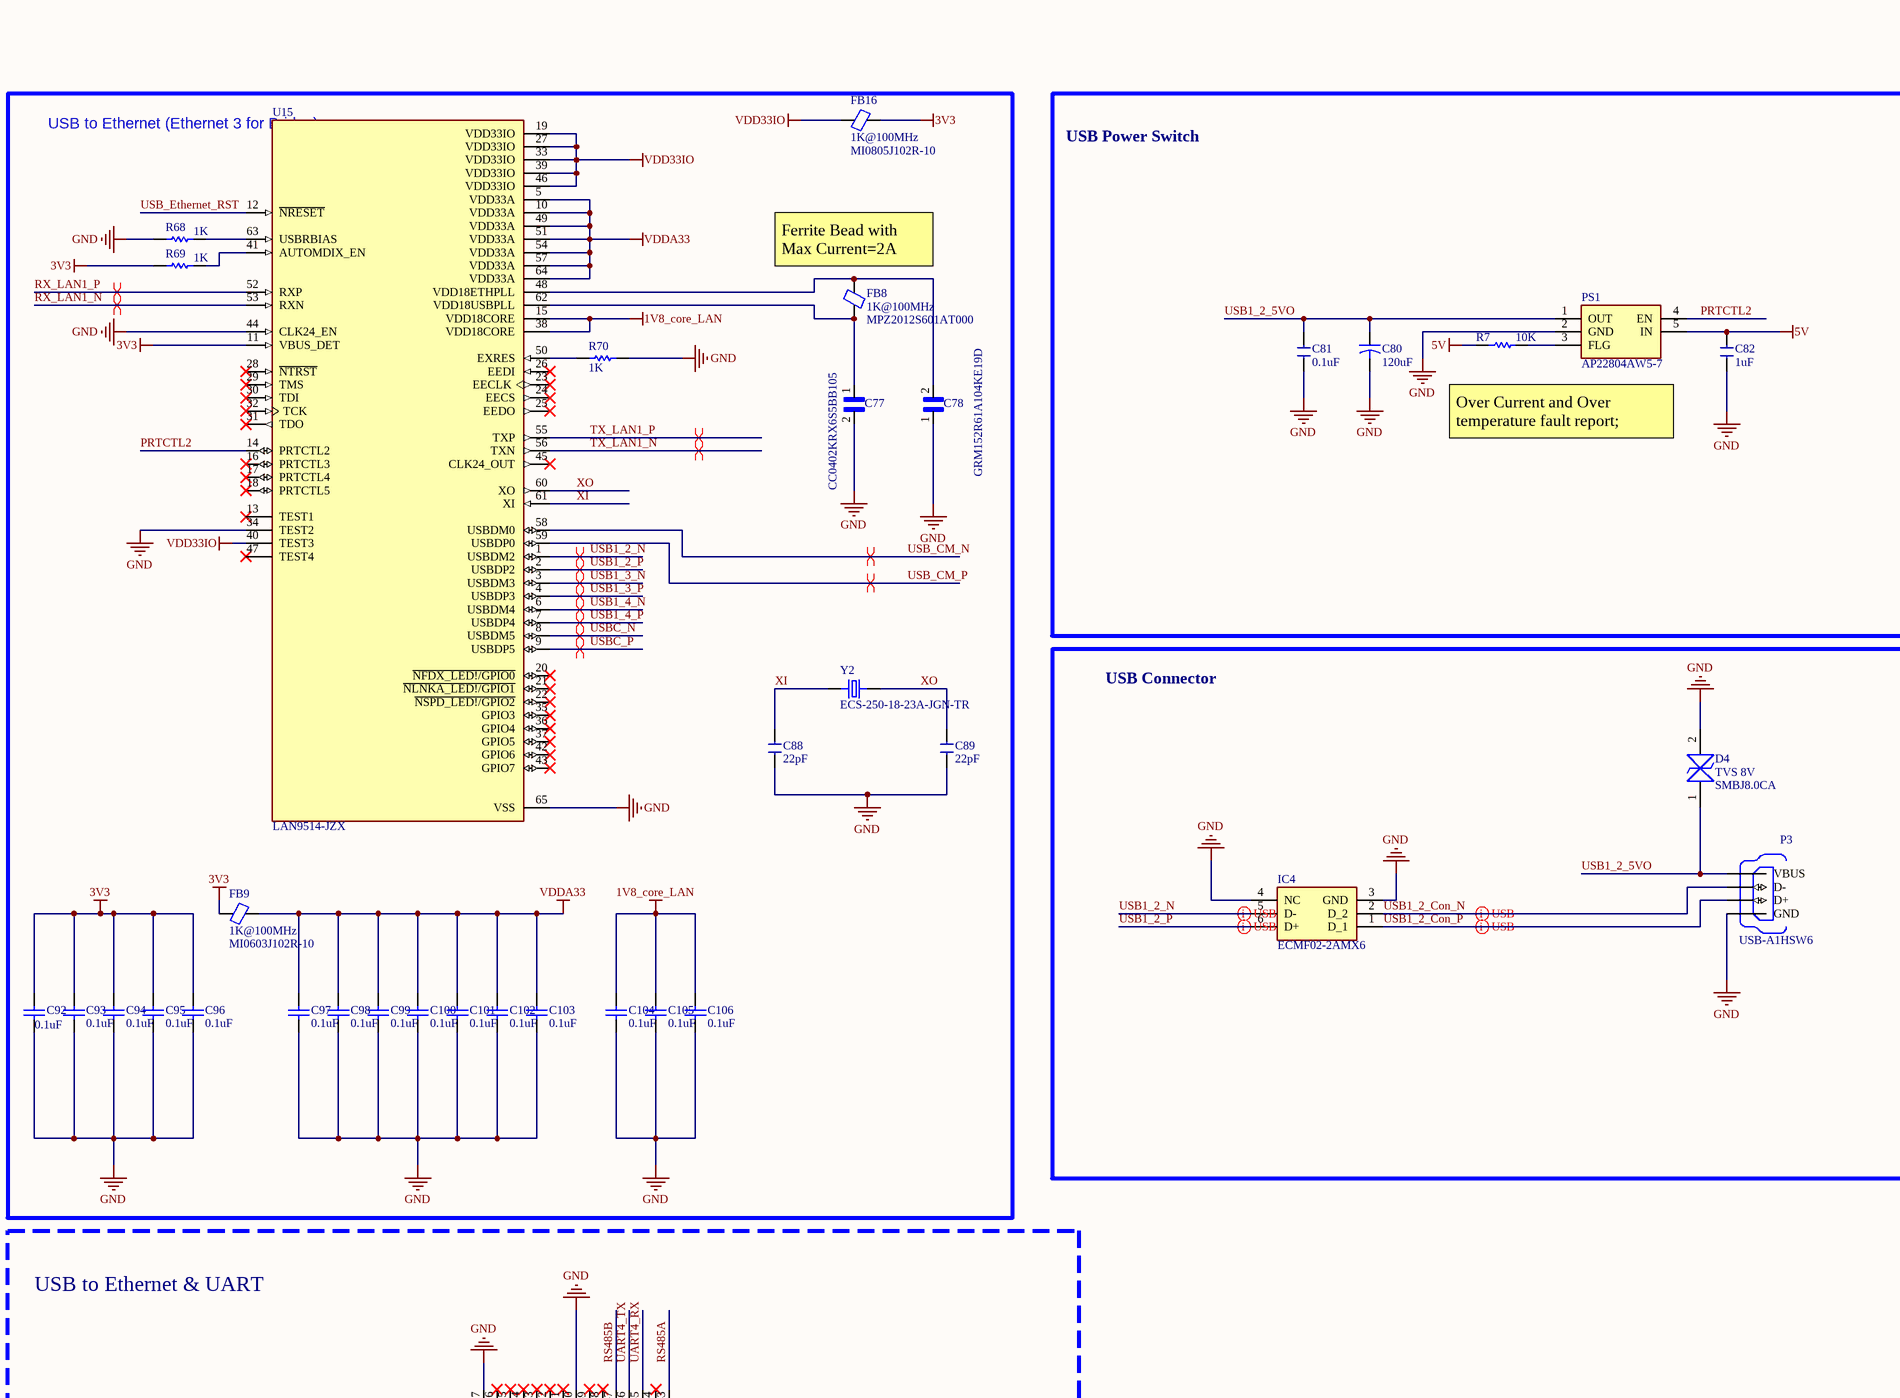
[diagram p10: USB_To_Ethernet.SchDoc, top middle]
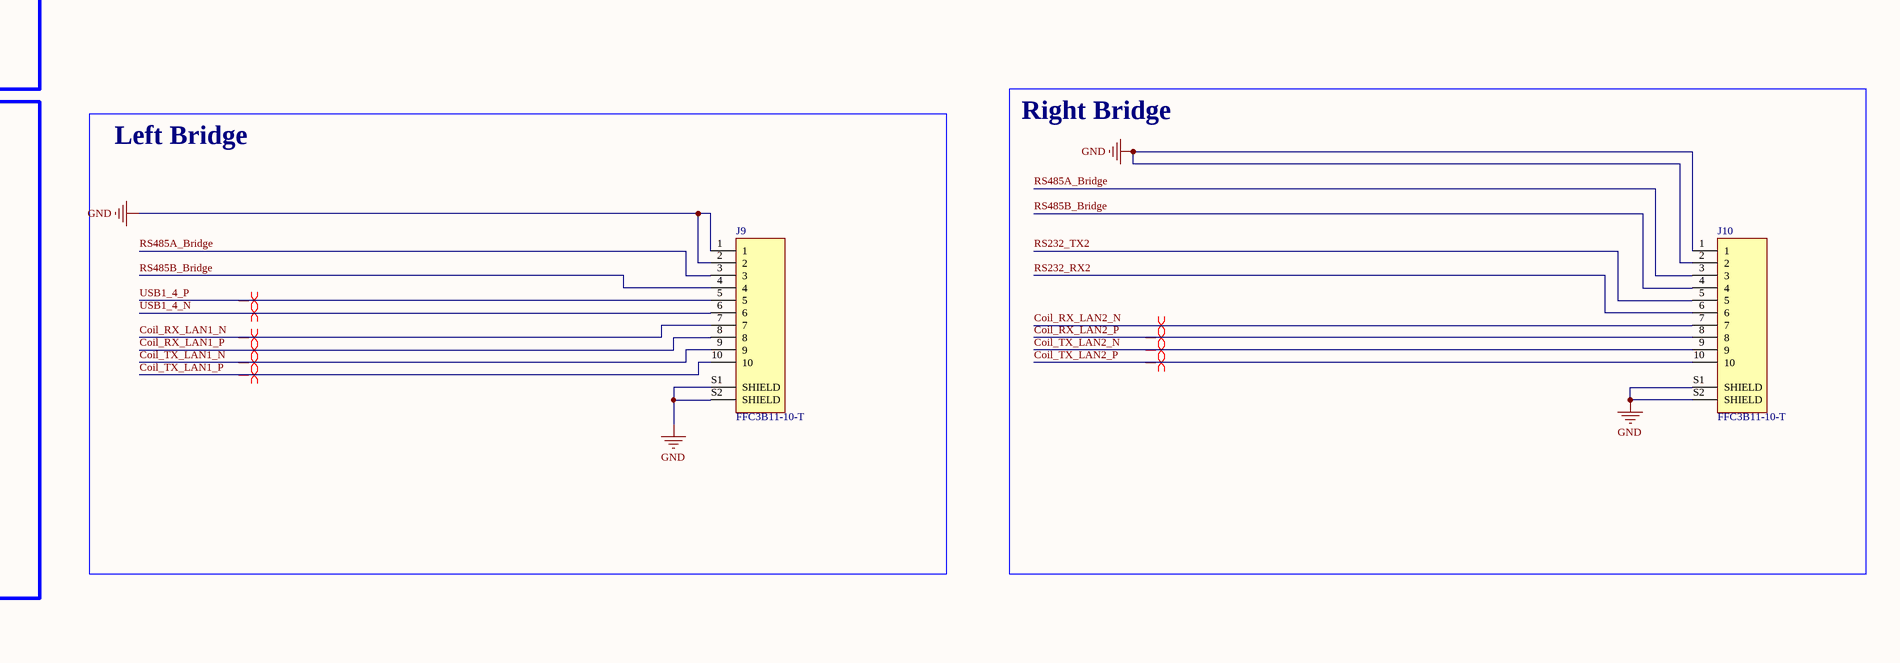
[diagram p11: USB_To_Ethernet.SchDoc, top right]
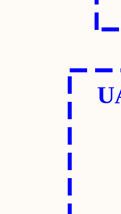
[diagram p12: USB_To_Ethernet.SchDoc, bottom left]
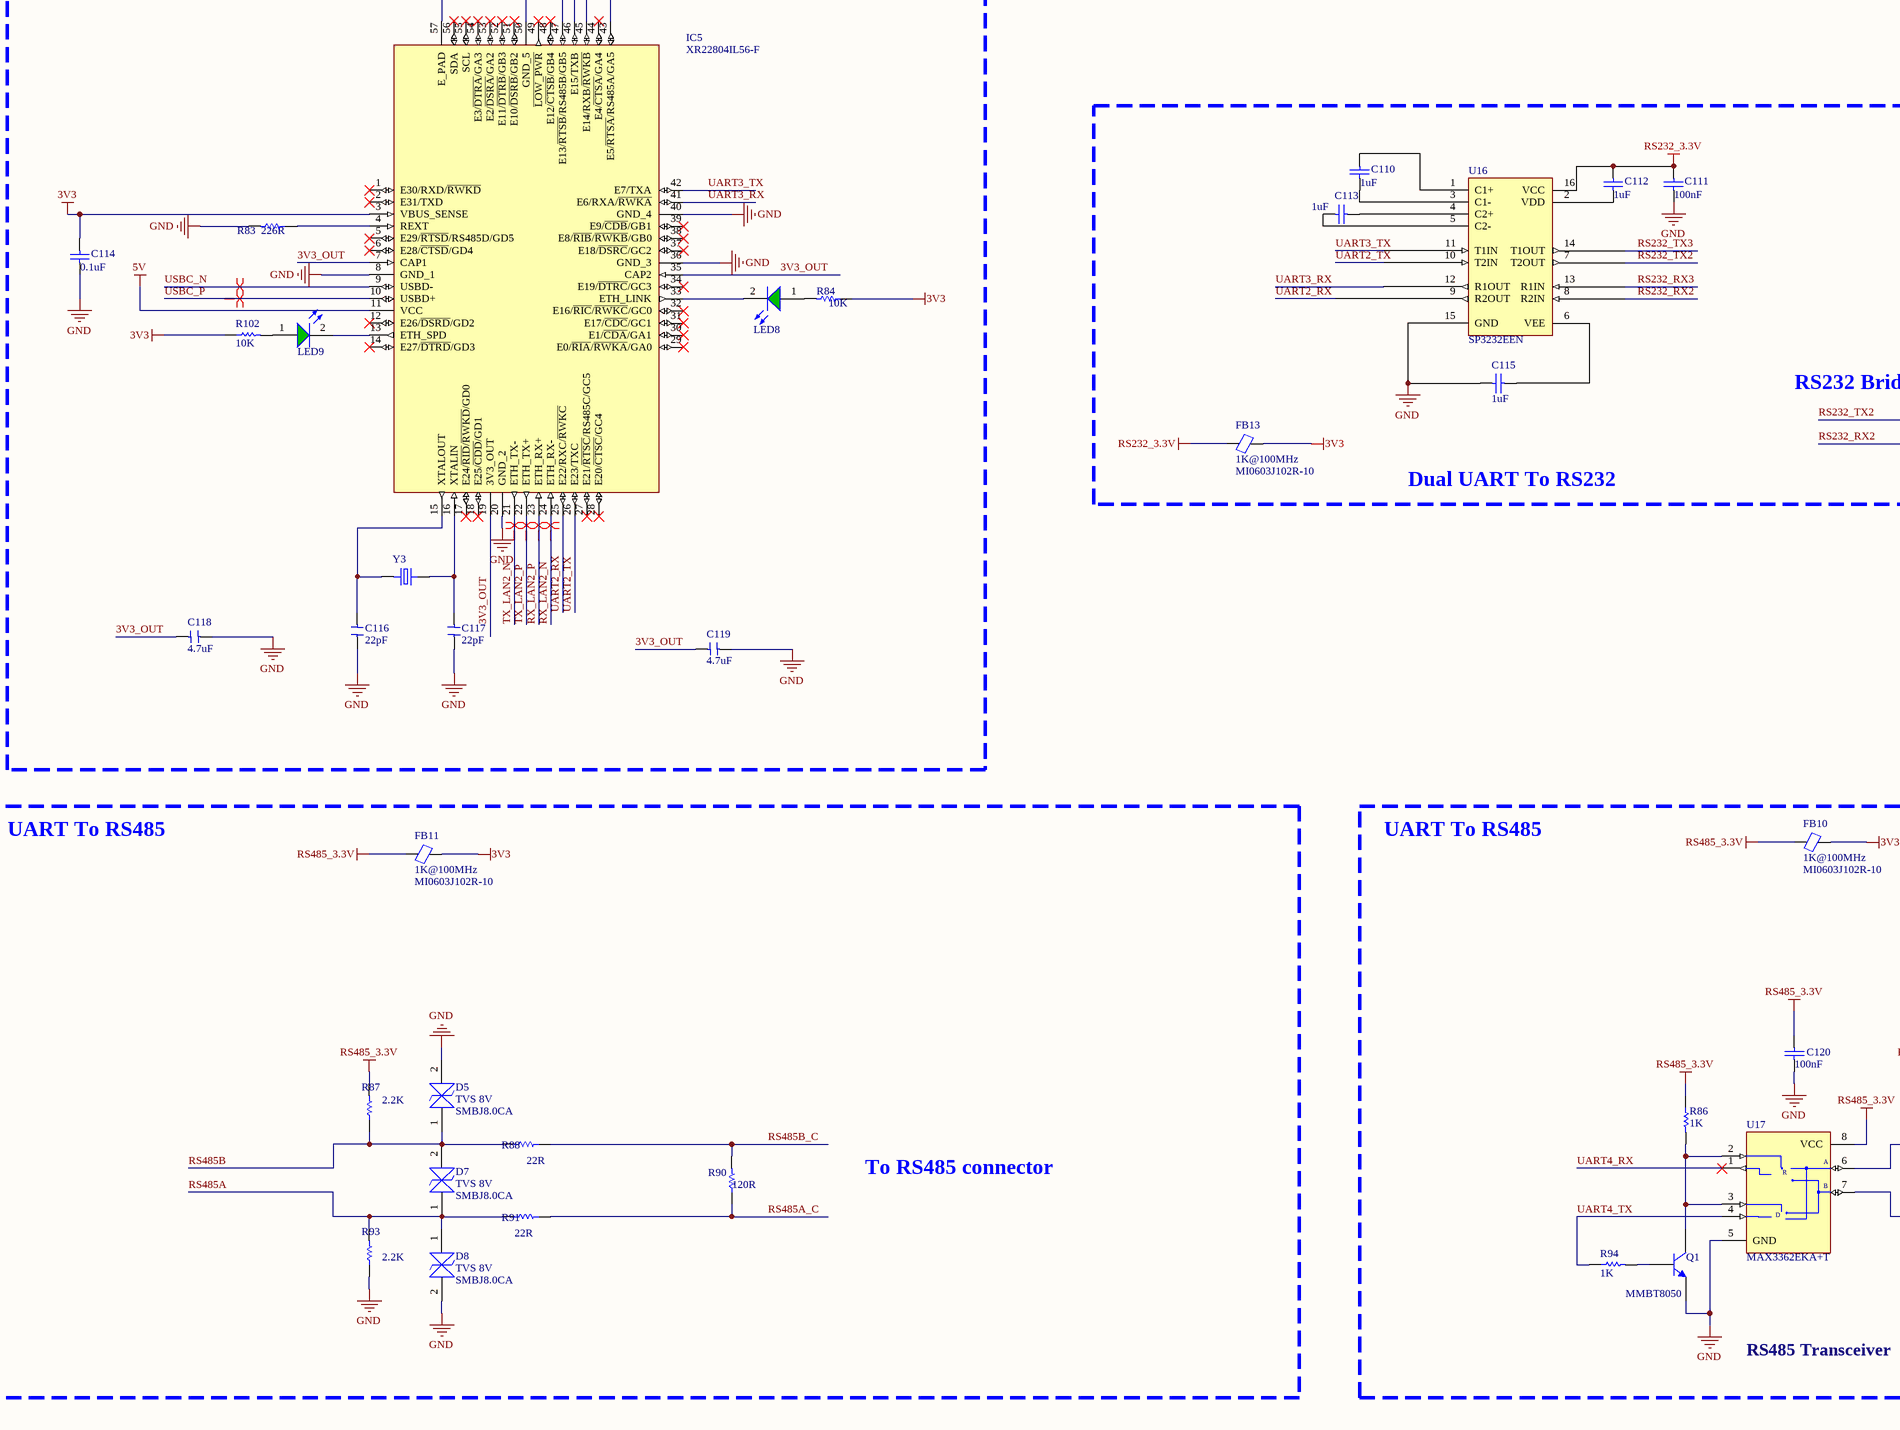
[diagram p13: USB_To_Ethernet.SchDoc, bottom middle]
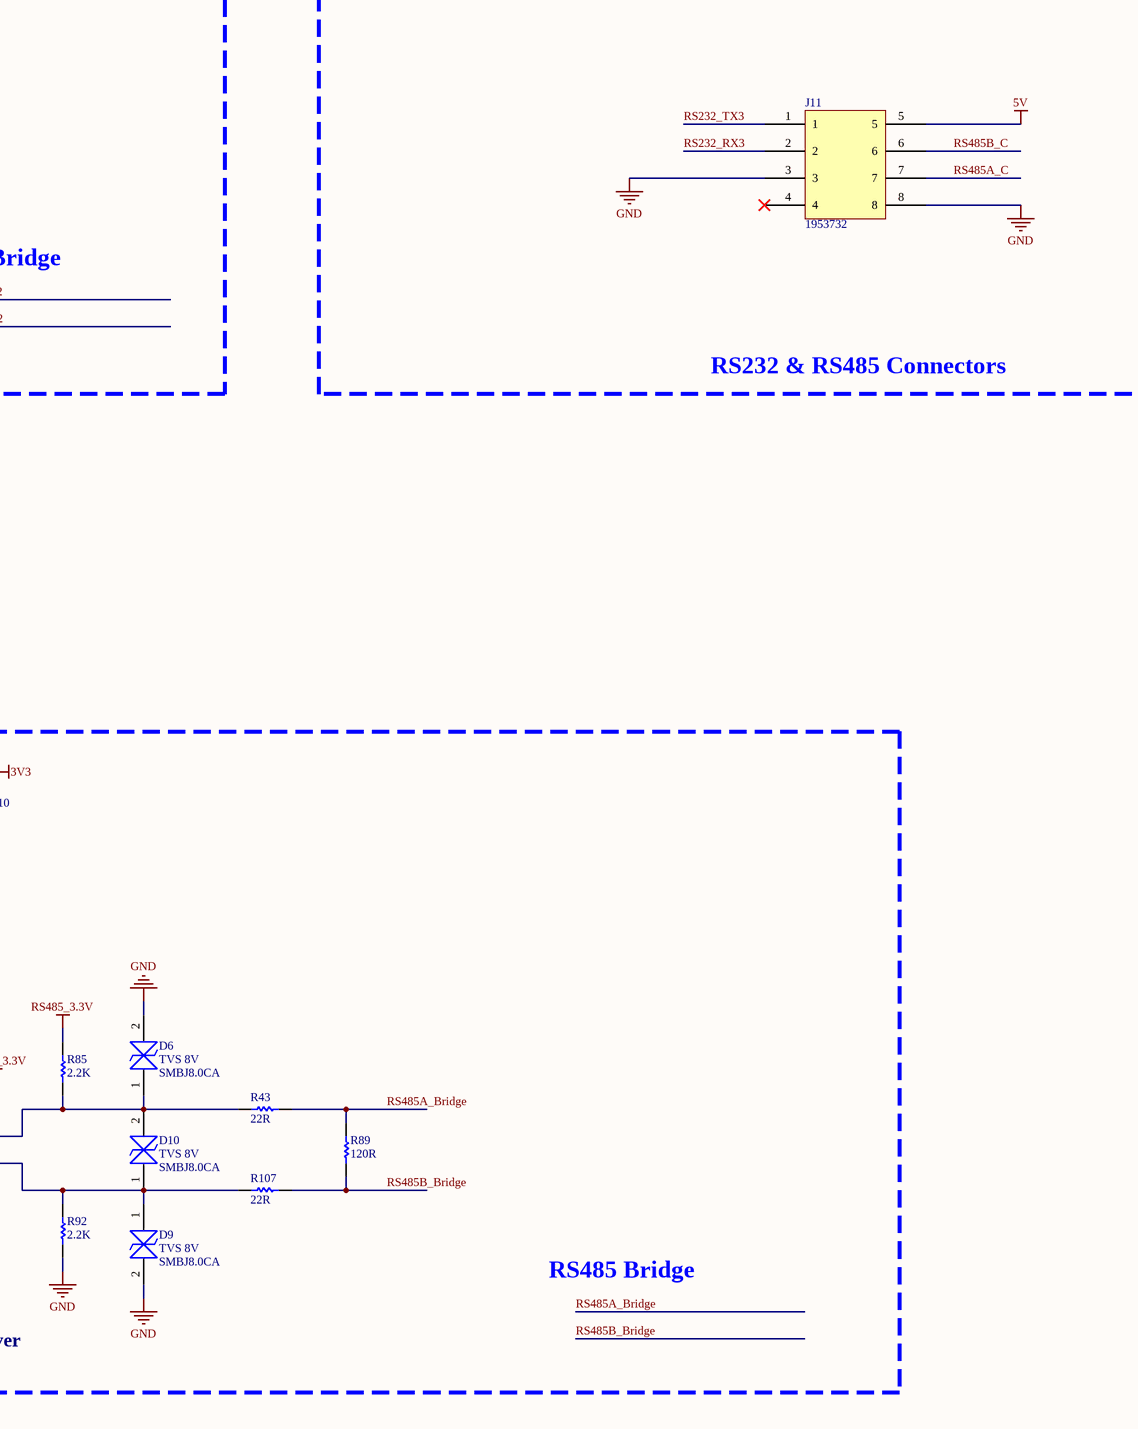
[diagram p14: USB_To_Ethernet.SchDoc, bottom right]

### Parts
(Parts that share a designator on the sheet are numbered #1, #2 ... from top to bottom, then left to right.)
C77  CC0402KRX6S5BB105  [CAPC1005X55N]
C78  GRM152R61A104KE19D  [CAPC1005X22N]
C80  value 120uF  [TANTAL (SIZE B)]  (hidden comment: Cap_Tantal)
C81#1  value 0.1uF  [0603 Capacitor]  (hidden comment: Capacitor SMD)
C82#1  value 1uF  [0603 Capacitor]  (hidden comment: Capacitor SMD)
C83#1  10nF  [CAP (0603)]
C84#1  10nF  [CAP (0603)]
C85#1  1nF  [CAP (0603)]
C86#1  100nF  [CAP (0603)]
C87#1  100nF  [CAP (0603)]
C88#1  value 22pF  [0603 Capacitor]  (hidden comment: Capacitor SMD)
C89#1  value 22pF  [0603 Capacitor]  (hidden comment: Capacitor SMD)
C90  10nF  [CAP (0603)]
C91  10nF  [CAP (0603)]
C92  0.1uF  [C0603]
C93  0.1uF  [C0603]
C94  0.1uF  [C0603]
C95  0.1uF  [C0603]
C96  0.1uF  [C0603]
C97  0.1uF  [C0603]
C98  0.1uF  [C0603]
C99  0.1uF  [C0603]
C100  0.1uF  [C0603]
C101  0.1uF  [C0603]
C102  0.1uF  [C0603]
C103  0.1uF  [C0603]
C104  0.1uF  [C0603]
C105  0.1uF  [C0603]
C106  0.1uF  [C0603]
C107  1nF  [CAP (0603)]
C108  100nF  [CAP (0603)]
C109  100nF  [CAP (0603)]
C110  1uF  [C0603]
C111  100nF  [C0603]
C112  1uF  [C0603]
C113  1uF  [C0603]
C114  0.1uF  [C0603]
C115  value 1uF  [C0603]
C116  value 22pF  [0603 Capacitor]  (hidden comment: Capacitor SMD)
C117  value 22pF  [0603 Capacitor]  (hidden comment: Capacitor SMD)
C118  value 4.7uF  [0603 Capacitor]  (hidden comment: Capacitor SMD)
C119  value 4.7uF  [0603 Capacitor]  (hidden comment: Capacitor SMD)
C120  value 100nF  [C1206]  (hidden comment: Cap Semi)
D4  TVS 8V  Part Number: SMBJ8.0CA  [DIOM5436X244N (SMB)]
D5  TVS 8V  Part Number: SMBJ8.0CA  [DIOM5436X244N (SMB)]
D6  TVS 8V  Part Number: SMBJ8.0CA  [DIOM5436X244N (SMB)]
D7  TVS 8V  Part Number: SMBJ8.0CA  [DIOM5436X244N (SMB)]
D8  TVS 8V  Part Number: SMBJ8.0CA  [DIOM5436X244N (SMB)]
D9  TVS 8V  Part Number: SMBJ8.0CA  [DIOM5436X244N (SMB)]
D10  TVS 8V  Part Number: SMBJ8.0CA  [DIOM5436X244N (SMB)]
FB8#1  value 1K@100MHz  Part Number: MPZ2012S601AT000  [FB0805]  (hidden comment: Ferrite Bead)
FB9  value 1K@100MHz  Part Number: MI0603J102R-10  [FB0603]  (hidden comment: Ferrite Bead)
FB10  value 1K@100MHz  Part Number: MI0603J102R-10  [FB0603]  (hidden comment: Ferrite Bead)
FB11  value 1K@100MHz  Part Number: MI0603J102R-10  [FB0603]  (hidden comment: Ferrite Bead)
FB13  value 1K@100MHz  Part Number: MI0603J102R-10  [FB0603]  (hidden comment: Ferrite Bead)
FB16  value 1K@100MHz  Part Number: MI0805J102R-10  [FB0805]  (hidden comment: Ferrite Bead)
IC4  ECMF02-2AMX6  [SON50P150X170X55-6N-D]
IC5  XR22804IL56-F  [QFN50P800X800X90-57N]
J9  FFC3B11-10-T  [PCBComponent_1]
J10  FFC3B11-10-T  [PCBComponent_1]
J11  1953732  [1953732]
LED8  150080GS75000  [LED_0805_Green]  (value not drawn)
LED9  150080GS75000  [LED_0805_Green]  (value not drawn)
P3  USB-A1HSW6  [OST_USB-A1HSW6]
PS1  AP22804AW5-7  [SOT95P285X140-5N]
Q1#1  MMBT8050  [SOT95P237X111-3N (SOT23)]
R7  value 10K  [RES (0603)]  (hidden comment: Res)
R43  value 22R  [RES (0603)]  (hidden comment: Res)
R68  value 1K  [R0603]  (hidden comment: Res)
R69  value 1K  [R0603]  (hidden comment: Res)
R70  value 1K  [R0603]  (hidden comment: Res)
R71  51R  [RES 0603]
R72#1  51R  [RES 0603]
R73  51R  [RES 0603]
R74  51R  [RES 0603]
R75  51R  [RES 0603]
R76  51R  [RES 0603]
R77  51R  [RES 0603]
R78  51R  [RES 0603]
R79#1  51R  [RES 0603]
R80#1  51R  [RES 0603]
R81#1  51R  [RES 0603]
R82  51R  [RES 0603]
R83  value 226R  [R0603]  (hidden comment: Res)
R84  value 10K  [R0603]  (hidden comment: Res)
R85  value 2.2K  [RES (0603)]  (hidden comment: Res)
R86  value 1K  [RES (0603)]  (hidden comment: Res)
R87  value 2.2K  [R0603]  (hidden comment: Res)
R88  value 22R  [R0603]  (hidden comment: Res)
R89  value 120R  [RES (0603)]  (hidden comment: Res)
R90  value 120R  [R0603]  (hidden comment: Res)
R91  value 22R  [R0603]  (hidden comment: Res)
R92  value 2.2K  [RES (0603)]  (hidden comment: Res)
R93  value 2.2K  [R0603]  (hidden comment: Res)
R94  value 1K  [RES (0603)]  (hidden comment: Res)
R102#1  value 10K  [RES (0603)]  (hidden comment: Res)
R107  value 22R  [RES (0603)]  (hidden comment: Res)
T2  Ethernet Coil  [SOIC127P940X597-16N (SOIC16)]
T3  Ethernet Coil  [SOIC127P940X597-16N (SOIC16)]
U15  LAN9514-JZX  [QFN50P900X900X100-65N730X730]
U16  SP3232EEN  [SOIC16_M]
U17  RS485 Transceiver  [SOT65P280X145-8N (SOT23)]  (value not drawn)
Y2  ECS-250-18-23A-JGN-TR  [XTAL_ECS-250-18-23A-JGN-TR]
Y3  ECS-250-18-23A-JGN-TR  [XTAL_ECS-250-18-23A-JGN-TR]  (value not drawn)

### Blocks framed on the sheet
USB to Ethernet (Ethernet 3 for Bridge): C77 C78 C88#1 C89#1 C92-C106 FB8#1 FB9 FB16 R68-R70 U15 Y2
USB Power Switch: C80 C81#1 C82#1 PS1 R7
Ethernet Coils: C83#1 C84#1 C85#1 C86#1 C87#1 C90 C91 C107-C109 R71 R72#1 R73-R78 R79#1 R80#1 R81#1 R82 T2 T3
USB Connector: D4 IC4 P3
Left Bridge: J9
Right Bridge: J10

### Nets
1V8_core_LAN: C104.2 C105.2 C106.2 U15.15(VDD18CORE) U15.38(VDD18CORE)
3V3: C92.2 C93.2 C94.2 C95.2 C96.2 C114.2 FB9.1 FB10.2 FB11.2 FB13.2 FB16.2 IC5.3(VBUS_SENSE) R69.2 R84.1 R102#1.1 U15.11(VBUS_DET)
5V: C82#1.1 IC5.11(VCC) J11.5 PS1.5(IN) R7.1
GND: C77.2 C78.1 C80.2 C81#1.2 C82#1.2 C83#1.1 C84#1.1 C85#1.1 C86#1.1 C87#1.1 C88#1.2 C89#1.2 C90.1 C91.1 C92.1 C93.1 C94.1 C95.1 C96.1 C97.1 C98.1 C99.1 C100.1 C101.1 C102.1 C103.1 C104.1 C105.1 C106.1 C107.1 C108.1 C109.1 C111.1 C114.1 C115.2 C116.2 C117.2 C118.2 C119.2 C120.2 D4.2(A) D5.2(A) D6.2(A) D8.2(A) D9.2(A) IC4.3(GND) IC4.4(NC) IC5.8(GND_1) IC5.20(GND_2) IC5.36(GND_3) IC5.40(GND_4) IC5.50(GND_5) IC5.57(E_PAD) J9.1 J9.2 J9.S1(SHIELD) J9.S2(SHIELD) J10.1 J10.2 J10.S1(SHIELD) J10.S2(SHIELD) J11.3 J11.8 P3.4(GND) PS1.2(GND) Q1#1.2(E) R68.2 R70.1 R83.2 R92.2 R93.1 U15.34(TEST2) U15.44(CLK24_EN) U15.65(VSS) U16.15(GND) U17.5(GND)
RS232_3.3V: C111.2 C112.2 FB13.1 U16.16(VCC)
RS485_3.3V: C120.1 FB10.1 FB11.1 R85.1 R86.1 R87.2 U17.8(VCC)
VDD33IO: FB16.1 U15.19(VDD33IO) U15.27(VDD33IO) U15.33(VDD33IO) U15.39(VDD33IO) U15.40(TEST3) U15.46(VDD33IO)
VDDA33: C97.2 C98.2 C99.2 C100.2 C101.2 C102.2 C103.2 FB9.2 U15.5(VDD33A) U15.10(VDD33A) U15.49(VDD33A) U15.51(VDD33A) U15.54(VDD33A) U15.57(VDD33A) U15.64(VDD33A)
3V3_OUT: C118.1 C119.1 IC5.7(CAP1) IC5.19(3V3_OUT) IC5.35(CAP2)
Coil_RX_LAN1_N: J9.7 T2.9(R-)
Coil_RX_LAN1_P: J9.8 T2.11(R+)
Coil_RX_LAN2_N: J10.7 T3.9(R-)
Coil_RX_LAN2_P: J10.8 T3.11(R+)
Coil_TX_LAN1_N: J9.9 T2.14(T-)
Coil_TX_LAN1_P: J9.10 T2.16(T+)
Coil_TX_LAN2_N: J10.9 T3.14(T-)
Coil_TX_LAN2_P: J10.10 T3.16(T+)
PRTCTL2: PS1.4(EN) U15.14(PRTCTL2)
RS232_RX2: J10.6 U16.8(R2IN)
RS232_RX3: J11.2 U16.13(R1IN)
RS232_TX2: J10.5 U16.7(T2OUT)
RS232_TX3: J11.1 U16.14(T1OUT)
RS485A: D7.1(K) D8.1(K) IC5.43(E5/~{RTSA}/RS485A/GA5) R91.2 R93.2
RS485A_Bridge: J9.3 J10.3 R43.2 R89.1
RS485A_C: J11.7 R90.1 R91.1
RS485B: D5.1(K) D7.2(A) IC5.47(E13/~{RTSB}/RS485B/GB5) R87.1 R88.2
RS485B_Bridge: J9.4 J10.4 R89.2 R107.2
RS485B_C: J11.6 R88.1 R90.2
RX_LAN1_N: R76.2 T2.8(RD-) U15.53(RXN)
RX_LAN1_P: R75.2 T2.6(RD+) U15.52(RXP)
RX_LAN2_N: IC5.24(ETH_RX-) R82.2 T3.8(RD-)
RX_LAN2_P: IC5.23(ETH_RX+) R81#1.2 T3.6(RD+)
TX_LAN1_N: R74.2 T2.3(TD-) U15.56(TXN)
TX_LAN1_P: R73.2 T2.1(TD+) U15.55(TXP)
TX_LAN2_N: IC5.21(ETH_TX-) R80#1.2 T3.3(TD-)
TX_LAN2_P: IC5.22(ETH_TX+) R79#1.2 T3.1(TD+)
UART2_RX: IC5.25(E22/RXC/~{RWKC}) U16.9(R2OUT)
UART2_TX: IC5.26(E23/TXC) U16.10(T2IN)
UART3_RX: IC5.41(E6/RXA/~{RWKA}) U16.12(R1OUT)
UART3_TX: IC5.42(E7/TXA) U16.11(T1IN)
UART4_RX: IC5.45(E14/RXB/~{RWKB}) U17.1(RO)
UART4_TX: IC5.46(E15/TXB) R94.1 U17.4(DI)
USB1_2_5VO: C80.1 C81#1.1 D4.1(K) P3.1(VBUS) PS1.1(OUT)
USB1_2_Con_N: IC4.2(D_2) P3.2(D-)
USB1_2_Con_P: IC4.1(D_1) P3.3(D+)
USB1_2_N: IC4.5(D-) U15.1(USBDM2)
USB1_2_P: IC4.6(D+) U15.2(USBDP2)
USB1_3_N: U15.3(USBDM3) ; off-sheet OFFSH_USB1_3_N  [also labelled OFFSH_USB1_3_N]
USB1_3_P: U15.4(USBDP3) ; off-sheet OFFSH_USB1_3_P  [also labelled OFFSH_USB1_3_P]
USB1_4_N: J9.6 U15.6(USBDM4)
USB1_4_P: J9.5 U15.7(USBDP4)
USB_CM_N: U15.58(USBDM0) ; off-sheet OFFSH_USB_CM_N  [also labelled OFFSH_USB_CM_N]
USB_CM_P: U15.59(USBDP0) ; off-sheet OFFSH_USB_CM_P  [also labelled OFFSH_USB_CM_P]
USB_Ethernet_RST: U15.12(~{NRESET}) ; off-sheet OFFSH_USB_Ethernet_RST  [also labelled OFFSH_USB_Ethernet_RST]
USBC_N: IC5.9(USBD-) U15.8(USBDM5)
USBC_P: IC5.10(USBD+) U15.9(USBDP5)
XI: C88#1.1 U15.61(XI) Y2.1(IN/OUT)
XO: C89#1.1 U15.60(XO) Y2.2(OUT/IN)
NetC77_1: C77.1 FB8#1.1 U15.62(VDD18USBPLL)
NetC78_2: C78.2 FB8#1.2 U15.48(VDD18ETHPLL)
NetC83#1_2: C83#1.2 C84#1.2 T2.2(TDC) T2.7(RDC)
NetC85#1_2: C85#1.2 R71.1 R72#1.1
NetC86#1_2: C86#1.2 R73.1 R74.1
NetC87#1_2: C87#1.2 R75.1 R76.1
NetC90_2: C90.2 C91.2 T3.2(TDC) T3.7(RDC)
NetC107_2: C107.2 R77.1 R78.1
NetC108_2: C108.2 R79#1.1 R80#1.1
NetC109_2: C109.2 R81#1.1 R82.1
NetC110_1: C110.1 U16.3(C1-)
NetC110_2: C110.2 U16.1(C1+)
NetC112_1: C112.1 U16.2(VDD)
NetC113_1: C113.1 U16.4(C2+)
NetC113_2: C113.2 U16.5(C2-)
NetC115_1: C115.1 U16.6(VEE)
NetC116_1: C116.1 IC5.15(XTALOUT) Y3.1(IN/OUT)
NetC117_1: C117.1 IC5.16(XTALIN) Y3.2(OUT/IN)
NetD6_1: D6.1(K) D10.2(A) R43.1 R85.2 U17.6(A)
NetD9_1: D9.1(K) D10.1(K) R92.1 R107.1 U17.7(B)
NetIC5_4: IC5.4(REXT) R83.1
NetIC5_13: IC5.13(ETH_SPD) LED9.2(C)
NetIC5_33: IC5.33(ETH_LINK) LED8.2(C)
NetLED8_1: LED8.1(A) R84.2
NetLED9_1: LED9.1(A) R102#1.2
NetPS1_3: PS1.3(FLG) R7.2
NetQ1#1_1: Q1#1.1(B) R94.2
NetQ1#1_3: Q1#1.3(C) R86.2 U17.2(~{RE}) U17.3(DE)
NetR68_1: R68.1 U15.63(USBRBIAS)
NetR69_1: R69.1 U15.41(AUTOMDIX_EN)
NetR70_2: R70.2 U15.50(EXRES)
NetR71_2: R71.2 T2.15(TXC)
NetR72#1_2: R72#1.2 T2.10(RXC)
NetR77_2: R77.2 T3.15(TXC)
NetR78_2: R78.2 T3.10(RXC)

Not connected (* = marked no-connect by the designer): IC5 1(E30/RXD/~{RWKD})* 2(E31/TXD)* 5(E29/~{RTSD}/RS485D/GD5)* 6(E28/~{CTSD}/GD4)* 12(E26/~{DSRD}/GD2)* 14(E27/~{DTRD}/GD3)* 17(E24/~{RID}/~{RWKD}/GD0)* 18(E25/~{CDD}/GD1)* 27(E21/~{RTSC}/RS485C/GC5)* 28(E20/~{CTSC}/GC4)* 29(E0/~{RIA}/~{RWKA}/GA0)* 30(E1/~{CDA}/GA1)* 31(E17/~{CDC}/GC1)* 32(E16/~{RIC}/~{RWKC}/GC0)* 34(E19/~{DTRC}/GC3)* 37(E18/~{DSRC}/GC2)* 38(E8/~{RIB}/~{RWKB}/GB0)* 39(E9/~{CDB}/GB1)* 44(E4/~{CTSA}/GA4)* 48(E12/~{CTSB}/GB4)* 49(~{LOW_PWR})* 51(E10/~{DSRB}/GB2)* 52(E11/~{DTRB}/GB3)* 53(E2/~{DSRA}/GA2)* 54(E3/~{DTRA}/GA3)* 55(SCL)* 56(SDA)*; J11 4*; T2 4(NC)* 5(NC)* 12(NC)* 13(NC)*; T3 4(NC)* 5(NC)* 12(NC)* 13(NC)*; U15 13(TEST1)* 16(PRTCTL3)* 17(PRTCTL4)* 18(PRTCTL5)* 20(~{NFDX_LED!/GPIO0})* 21(~{NLNKA_LED!/GPIO1})* 22(~{NSPD_LED!/GPIO2})* 23(EECLK)* 24(EECS)* 25(EEDO)* 26(EEDI)* 28(~{NTRST})* 29(TMS)* 30(TDI)* 31(TDO)* 32(TCK)* 35(GPIO3)* 36(GPIO4)* 37(GPIO5)* 42(GPIO6)* 43(GPIO7)* 45(CLK24_OUT)* 47(TEST4)*

### Layout directives
differential pair: Coil_RX_LAN1_N, Coil_RX_LAN1_P, Coil_RX_LAN2_N, Coil_RX_LAN2_P, Coil_TX_LAN1_N, Coil_TX_LAN1_P, Coil_TX_LAN2_N, Coil_TX_LAN2_P, RX_LAN1_N, RX_LAN1_P, RX_LAN2_N, RX_LAN2_P, TX_LAN1_N, TX_LAN1_P, TX_LAN2_N, TX_LAN2_P, USB1_2_N, USB1_2_P, USB1_3_N, USB1_3_P, USB1_4_N, USB1_4_P, USB_CM_N, USB_CM_P, USBC_N, USBC_P
differential pair; differential pair class ETH; net class ETHT: TX_LAN1_N, TX_LAN1_P, TX_LAN2_N, TX_LAN2_P
differential pair; differential pair class ETH; net class ETHR: RX_LAN1_P, RX_LAN2_P
differential pair; differential pair class ETH: RX_LAN1_N, RX_LAN2_N
differential pair; differential pair class ETH; net class ETH_T: Coil_TX_LAN1_N, Coil_TX_LAN1_P, Coil_TX_LAN2_N, Coil_TX_LAN2_P
differential pair; differential pair class ETH; net class ETH_R: Coil_RX_LAN1_N, Coil_RX_LAN1_P, Coil_RX_LAN2_N, Coil_RX_LAN2_P
differential pair; net class USB: USB1_2_Con_N, USB1_2_Con_P, USB1_2_N, USB1_2_P

### Notes on the sheet
- (near FB8#1) Ferrite Bead with Max Current=2A
- Over Current and Over temperature fault report;
- USB to Ethernet & UART
- RS232 Bridge
- Dual UART To RS232
- RS232 & RS485 Connectors
- UART To RS485
- To RS485 connector
- RS485 Bridge
- RS485 Transceiver
- (in symbol MAX3362EKA+T) R; D

### Library data of the parts
C77 = CC0402KRX6S5BB105: CAP CER 1UF 6.3V X6S 0402; Package: None; Price: None; Value: *; MP: CC0402KRX6S5BB105; Availability: Unavailable
C78 = GRM152R61A104KE19D: CAP CER 0.1UF 10V X5R 0402; Package: None; Price: None; Value: *; MP: GRM152R61A104KE19D; Availability: Unavailable
C80 = Cap_Tantal: Tantalum Capacitor; Voltage: 10V
C81#1 C82#1 C88#1 C89#1 C116-C119 = Capacitor SMD: Voltage: 50v
C83#1 C84#1 C85#1 C86#1 C87#1 C90 C91 C107-C109 = Cap: SMD capacitor
  C83#1 C84#1 C90 C91: Value: 10nF
  C85#1 C107: Value: 1nF
  C86#1 C87#1 C108 C109: Value: 100nF
C92-C106 C110-C114 = Cap Semi: Capacitor (Semiconductor SIM Model); Value: 2.2nf; Published: 8-Jun-2000; LatestRevisionDate: 17-Jul-2002; LatestRevisionNote: Re-released for DXP Platform.; PackageReference: C1206; Publisher: Altium Limited
C115 C120 = Cap Semi: Capacitor (Semiconductor SIM Model); Published: 8-Jun-2000; LatestRevisionDate: 29-May-2009; LatestRevisionNote: IPC-7351 Footprint Added.; PackageReference: C1206; Publisher: Altium Limited; PackageDescription: Chip Capacitor
D4 D5 D8 = SMBJ6.0CA: Bidirectional TVS 8V SMB; Manufacturer_Name: Littelfuse; Datasheet Link: https://www.littelfuse.com/~/media/electronics/datasheets/tvs_diodes/littelfuse_tvs_diode_smbj_datasheet.pdf.pdf; Height: 2.44mm; Link: https://www.digikey.sg/product-detail/en/littelfuse-inc/SMBJ6.0CA/SMBJ6.0CALFCT-ND/286102
D6 D7 D9 D10 = SMBJ6.0CA: Bidirectional TVS 6V SMB; Manufacturer_Name: Littelfuse; Datasheet Link: https://www.littelfuse.com/~/media/electronics/datasheets/tvs_diodes/littelfuse_tvs_diode_smbj_datasheet.pdf.pdf; Height: 2.44mm; Link: https://www.digikey.sg/product-detail/en/littelfuse-inc/SMBJ6.0CA/SMBJ6.0CALFCT-ND/286102
FB8#1 FB9-FB11 FB13 FB16 = Ferrite Bead: Ferrite Bead SMD; Link: https://www.digikey.com/product-detail/en/laird-signal-integrity-products/MI0805J102R-10/240-2551-1-ND/1015989
IC4 = ECMF02-2AMX6: Integrated Circuit; Manufacturer_Name: STMicroelectronics; Datasheet Link: http://www.st.com/content/ccc/resource/technical/document/datasheet/3a/28/cf/d0/31/63/48/8c/CD00282307.pdf/files/CD00282307.pdf/jcr:content/translations/en.CD00282307.pdf; Height: 0.55mm; Part Number: ECMF02-2AMX6; Mouser Part Number: 511-ECMF02-2AMX6; Mouser Price/Stock: https://www.mouser.com/Search/Refine.aspx?Keyword=511-ECMF02-2AMX6; RS Part Number: 8805276P; RS Price/Stock: http://uk.rs-online.com/web/p/products/8805276P
IC5 = XR22804IL56-F: Integrated Circuit; Manufacturer_Name: EXAR; Datasheet Link: https://www.exar.com/ds/xr22804_1b_04152015.pdf; Height: 1mm; Manufacturer_Part_Number: XR22804IL56-F; Mouser Part Number: 701-22804IL56-F; Mouser Price/Stock: https://www.mouser.com/Search/Refine.aspx?Keyword=701-22804IL56-F; Arrow Part Number: XR22804IL56-F; Arrow Price/Stock: https://www.arrow.com/en/products/xr22804il56-f/exar
J9 J10 = FFC3B11-10-T: 10 Position FFC, FPC Connector Contacts, Top 0.039 _1.00mm_ Surface Mount, Right Angle; MF: Global Connector Technology; Value: *; Availability: Unavailable; Price: None; SnapEDA_Link: https://www.snapeda.com/parts/FFC3B11-10-T/Global%20Connector%20Technology/view-part/4223050/?ref=snap; Package: Package Analog Devices; MP: FFC3B11-10-T
J11 = P?: Part Number: 1953732
LED8 = WL-SMCW 0805  150080GS75000: SMD mono-color Chip LED, WL-SMCW, Yellow; Manufacturer: W黵th Elektronik eiSos GmbH; Color: Green; PartNo: 150080GS75000; ComponentLink1Description: Manufacturer; ComponentLink1URL: http://www.we-online.de; Created by: Christin Otto; Created Date: June 2013; ComponentLink2Description: Datasheet; ComponentLink2URL: http://katalog.we-online.com/led/datasheet/150080GS75000.pdf
LED9 = WL-SMCW 0805  150080GS75000: as LED5 on sheet Power_Supply; PartNo: 150080GS75000; ComponentLink1Description: Manufacturer; ComponentLink1URL: http://www.we-online.de; Created by: Christin Otto; Created Date: June 2013; ComponentLink2Description: Datasheet; ComponentLink2URL: http://katalog.we-online.com/led/datasheet/150080GS75000.pdf; Color: Green
P3 = USB-A1HSW6: USB-A _USB TYPE-A_  Receptacle Connector 4 Position Through Hole, Right Angle; MF: On Shore; SnapEDA_Link: https://www.snapeda.com/parts/USB-A1HSW6/On%20Shore%20Technology%20Inc./view-part/13110/?ref=snap; Package: None; MP: USB-A1HSW6; Availability: Unavailable; Price: None; Value: *
PS1 = AP22804AW5-7: Power Supply; Manufacturer_Name: Diodes Inc.; Datasheet Link: https://componentsearchengine.com/Datasheets/2/AP22804AW5-7.pdf; Height: 1.4mm; Manufacturer_Part_Number: AP22804AW5-7; Mouser Part Number: 621-AP22804AW5-7; Mouser Price/Stock: https://www.mouser.co.uk/ProductDetail/Diodes-Incorporated/AP22804AW5-7?qs=lqAf%2FiVYw9hgcUuNhFapmA%3D%3D; Arrow Part Number: AP22804AW5-7; Arrow Price/Stock: https://www.arrow.com/en/products/ap22804aw5-7/diodes-incorporated
Q1#1 = MMBT8050: NPN General Purpose Amplifier; Link: https://www.alibaba.com/product-detail/100-MMBT8050-SOT-23-J3Y-S8050_60584077590.html; Part Number: MMBT8050
R7 R43 R71 R72#1 R73-R78 R79#1 R80#1 R81#1 R82 R85 R86 R89 R92 R94 R102#1 R107 = Res: SMD resistor; Tolerance: 5%
  R71 R72#1 R77 R78: Value: 51R
  R73-R76 R79#1 R80#1 R81#1 R82: Value: 51r
R68-R70 R83 R84 R87 R88 R90 R91 R93 = Res: Resistor; Published: 8-Jun-2000; LatestRevisionDate: 17-Jul-2002; LatestRevisionNote: Re-released for DXP Platform.; PackageReference: AXIAL-0.3; Publisher: Altium Limited
T2 T3 = H1102NL: Ethernet Transformer; Manufacturer_Name: Pulse; Datasheet Link: https://productfinder.pulseeng.com/products/datasheets/h1102nl.pdf; Height: 5.97mm; Part Number: H1102NL
U15 = LAN9514-JZX: Ethernet Bridge, USB to Ethernet USB 2.0, 10/100 Base-T/TX PHY USB Interface 64-QFN _9x9_; MF: Microchip; MP: LAN9514-JZX; Availability: Unavailable; SnapEDA_Link: https://www.snapeda.com/parts/LAN9514-JZX/Microchip/view-part/105106/?ref=snap; Package: QFN-64 Microchip; Value: *; Price: None
U16 = MAX232CSE: IC TXRX RS232 ESD TRUE 16SOIC; Published: 16-Jan-2001; LatestRevisionDate: 13-Apr-2006; LatestRevisionNote: IPC-7351 Footprint Added.; PackageReference: NSO16; Publisher: Altium Limited; PackageDescription: 16-Pin Small Outline Integrated Circuit 1.27 mm Pitch; Code_JEDEC: MS-012-AC; Code_IPC: SOIC127P600-16; ComponentLink1Description: Manufacturer Link; ComponentLink1URL: http://www.maxim-ic.com/; ComponentLink2Description: Datasheet; ComponentLink2URL: http://pdfserv.maxim-ic.com/en/ds/MAX220-MAX249.pdf
U17 = MAX3362EKA+T: Manufacturer_Name: Maxim Integrated; Datasheet Link: http://docs-emea.rs-online.com/webdocs/0f71/0900766b80f71b05.pdf; Height: 1.45mm; Link: https://www.digikey.sg/product-detail/en/maxim-integrated/MAX3362EKA-T/MAX3362EKA-TCT-ND/9681401; Part Number: MAX3362EKA+T
Y2 Y3 = ECS-250-18-23A-JGN-TR: Crystal 2-SMD, No Lead; Package: None; Price: None; Value: *; MP: ECS-250-18-23A-JGN-TR; Availability: Unavailable